# Altium project pay-ssm.PrjPCB (part 1 of 2)
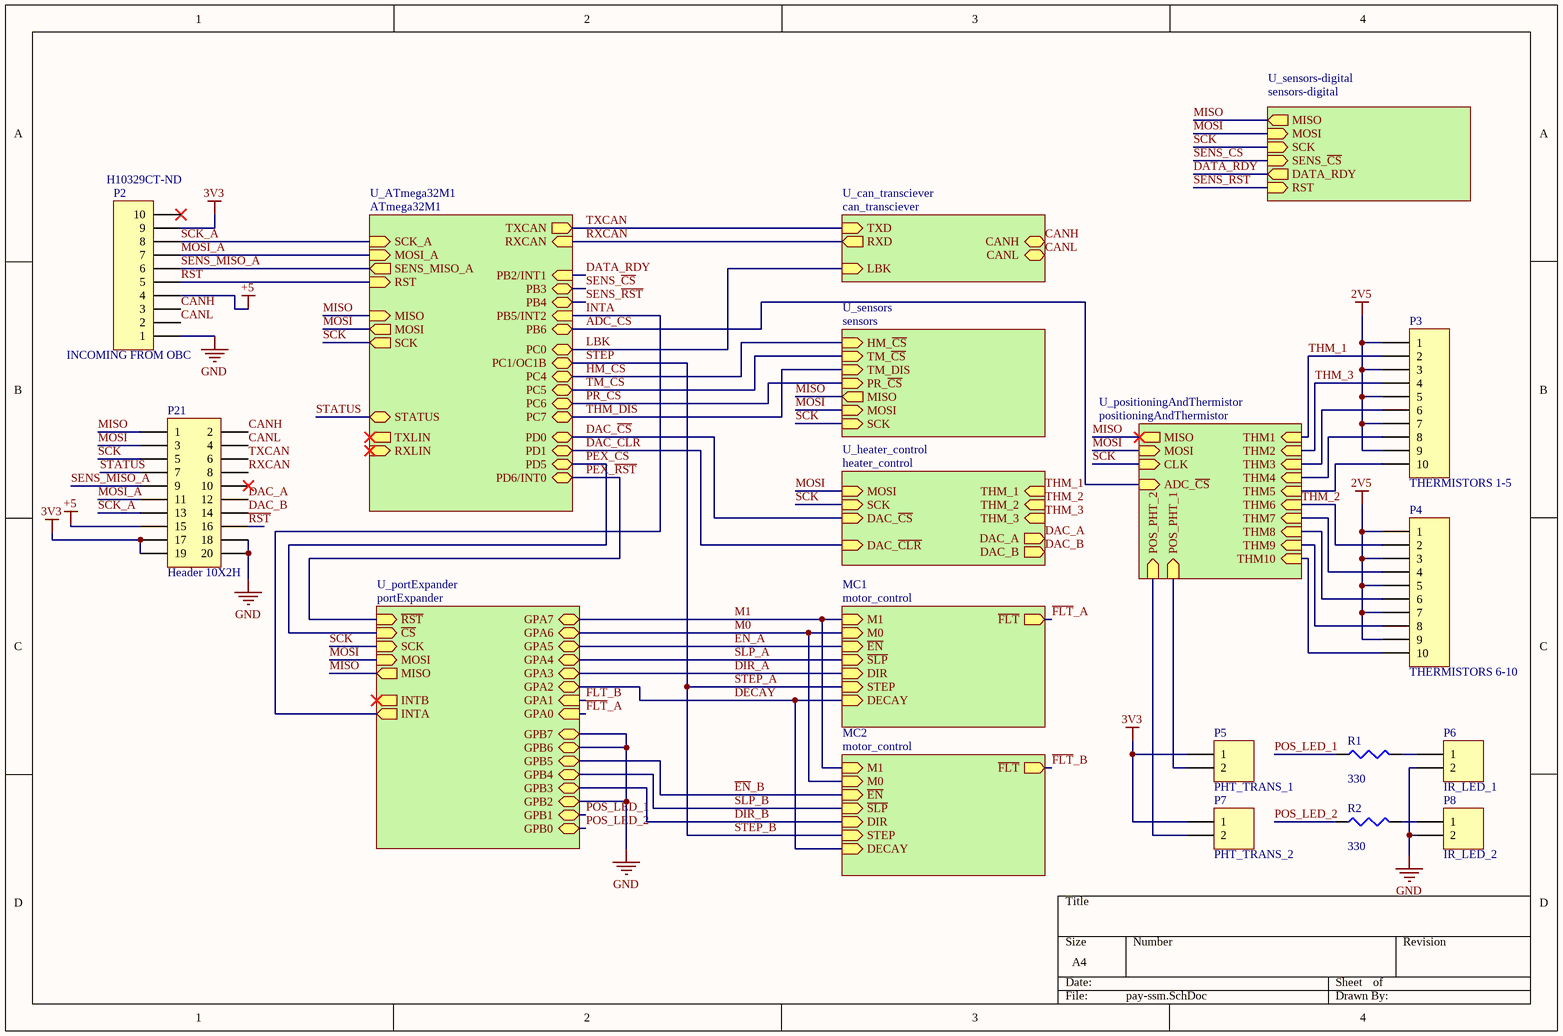
[diagram p0: pay-ssm.SchDoc]
13 sheets, 199 parts. Net scope: hierarchical (ports join the sheet entries above them; power ports are global).
Board files: pay-ssm.PcbDoc, pay-panel.PcbDoc
Sheets:
  pay-ssm.SchDoc
    U_ATmega32M1 = ATmega32M1.SchDoc
    U_can_transciever = can_transciever.SchDoc
    U_sensors = sensors.SchDoc
    U_heater_control = heater_control.SchDoc
      U_dac-layout = dac-layout.SchDoc
    MC2 = motor_control.SchDoc
    U_portExpander = portExpander.SchDoc
    MC1 = motor_control.SchDoc
    U_positioningAndThermistor = positioningAndThermistor.SchDoc
      U_thermistorADC = thermistorADC.SchDoc
    U_sensors-digital = sensors-digital.SchDoc
      optical_micro = microcontrollerOptical.SchDoc
  power2V5.SchDoc

## Sheet pay-ssm.SchDoc
size A4; DocumentNumber: 1; SheetNumber: 1; SheetTotal: 11

### Parts
P2  INCOMING FROM OBC  Supplier Part Number: H10329CT-ND  [DF14-10P-1.25H(55)]
P3  THERMISTORS 1-5  [DF14-10P-1.25H(55)]
P4  THERMISTORS 6-10  [DF14-10P-1.25H(55)]
P5  PHT_TRANS_1  [DF14-2P-1.25H(55)]
P6  IR_LED_1  [DF14-2P-1.25H(55)]
P7  PHT_TRANS_2  [DF14-2P-1.25H(55)]
P8  IR_LED_2  [DF14-2P-1.25H(55)]
P21  Header 10X2H  [HDR2X10]
R1  330  [J1-0603]
R2  330  [J1-0603]

### Sub-sheets
MC1 = motor_control: M1 (in), M0 (in), ~{EN} (in), ~{SLP} (in), DIR (in), STEP (in), DECAY (in), ~{FLT} (out)
MC2 = motor_control: M1 (in), M0 (in), ~{EN} (in), ~{SLP} (in), DIR (in), STEP (in), DECAY (in), ~{FLT} (out)
U_ATmega32M1 = ATmega32M1: MISO (in), MOSI (out), SCK (out), TXCAN (out), RXCAN (in), PB3 (bidir), PB4 (bidir), PB5/INT2 (in), PB6 (bidir), PC0 (bidir), PC4 (bidir), PC5 (bidir), PC6 (bidir), PC7 (bidir), PD0 (bidir), PD1 (bidir), PD5 (bidir), RXLIN (in), TXLIN (out), RST (in), MOSI_A (in), SCK_A (in), SENS_MISO_A (out), PC1/OC1B (bidir), PD6/INT0 (bidir), PB2/INT1 (in), STATUS (bidir)
U_can_transciever = can_transciever: RXD (out), TXD (in), LBK (in), CANL (bidir), CANH (bidir)
U_heater_control = heater_control: SCK (in), DAC_~{CLR} (in), MOSI (in), THM_2 (in), DAC_~{CS} (in), THM_1 (in), THM_3 (in), DAC_A (out), DAC_B (out)
U_portExpander = portExpander: ~{RST} (in), ~{CS} (in), SCK (in), MOSI (in), MISO (out), GPA7 (bidir), GPA6 (bidir), GPA5 (bidir), GPA4 (bidir), GPA3 (bidir), GPA2 (bidir), GPA1 (in), GPA0 (in), GPB7 (bidir), GPB6 (bidir), GPB5 (bidir), GPB4 (bidir), GPB3 (bidir), GPB2 (bidir), GPB1 (bidir), GPB0 (bidir), INTB (out), INTA (out)
U_positioningAndThermistor = positioningAndThermistor: THM1 (in), THM2 (in), THM3 (in), THM4 (in), THM5 (in), THM6 (in), THM7 (in), THM8 (in), THM9 (in), THM10 (in), MISO (out), MOSI (in), CLK (in), POS_PHT_2 (in), POS_PHT_1 (in), ADC_~{CS} (in)
U_sensors = sensors: HM_~{CS} (in), TM_~{CS} (in), TM_DIS (in), PR_~{CS} (in), SCK (in), MOSI (in), MISO (out)
U_sensors-digital = sensors-digital: MISO (out), MOSI (in), SCK (in), SENS_~{CS} (in), DATA_RDY (out), RST (in)

### Nets
2V5: P3.1 P3.3 P3.5 P3.7 P3.9 P4.1 P4.3 P4.5 P4.7 P4.9
3V3: P2.9 P5.1 P7.1 P21.17 P21.19
+5: P2.4 P21.15
GND: P2.1 P6.2 P8.2 P21.18 P21.20 ; sheet U_portExpander/GPB7, sheet U_portExpander/GPB6, sheet U_portExpander/GPB2
ADC_~{CS}: sheet U_ATmega32M1/PB6, sheet U_positioningAndThermistor/ADC_~{CS}
CANH: P2.3 P21.2 ; sheet U_can_transciever/CANH
CANL: P2.2 P21.4 ; sheet U_can_transciever/CANL
CH2: P3.6 ; sheet U_positioningAndThermistor/THM3
CH3: P3.8 ; sheet U_positioningAndThermistor/THM4
CH4: P3.10 ; sheet U_positioningAndThermistor/THM5
CH6: P4.6 ; sheet U_positioningAndThermistor/THM8
CH7: P4.4 ; sheet U_positioningAndThermistor/THM7
CH8: P4.8 ; sheet U_positioningAndThermistor/THM9
CH9: P4.10 ; sheet U_positioningAndThermistor/THM10
DAC_A: P21.12 ; sheet U_heater_control/DAC_A
DAC_B: P21.14 ; sheet U_heater_control/DAC_B
DAC_~{CLR}: sheet U_ATmega32M1/PD1, sheet U_heater_control/DAC_~{CLR}
DAC_~{CS}: sheet U_ATmega32M1/PD0, sheet U_heater_control/DAC_~{CS}
DATA_RDY: sheet U_ATmega32M1/PB2/INT1, sheet U_sensors-digital/DATA_RDY
DECAY: sheet MC2/DECAY, sheet U_portExpander/GPA2, sheet MC1/DECAY
DIR_A: sheet U_portExpander/GPA3, sheet MC1/DIR
DIR_B: sheet MC2/DIR, sheet U_portExpander/GPB3
~{EN}_A: sheet U_portExpander/GPA5, sheet MC1/~{EN}
~{EN}_B: sheet MC2/~{EN}, sheet U_portExpander/GPB5
~{FLT}_A: sheet U_portExpander/GPA0, sheet MC1/~{FLT}
~{FLT}_B: sheet MC2/~{FLT}, sheet U_portExpander/GPA1
HM_~{CS}: sheet U_ATmega32M1/PC4, sheet U_sensors/HM_~{CS}
INTA: sheet U_ATmega32M1/PB5/INT2, sheet U_portExpander/INTA
LBK: sheet U_ATmega32M1/PC0, sheet U_can_transciever/LBK
M0: sheet MC2/M0, sheet U_portExpander/GPA6, sheet MC1/M0
M1: sheet MC2/M1, sheet U_portExpander/GPA7, sheet MC1/M1
MISO: P21.1 ; sheet U_ATmega32M1/MISO, sheet U_sensors/MISO, sheet U_portExpander/MISO, sheet U_positioningAndThermistor/MISO, sheet U_sensors-digital/MISO
MOSI: P21.3 ; sheet U_ATmega32M1/MOSI, sheet U_sensors/MOSI, sheet U_heater_control/MOSI, sheet U_portExpander/MOSI, sheet U_positioningAndThermistor/MOSI, sheet U_sensors-digital/MOSI
MOSI_A: P2.7 P21.11 ; sheet U_ATmega32M1/TXLIN, sheet U_ATmega32M1/MOSI_A
PEX_~{CS}: sheet U_ATmega32M1/PD5, sheet U_portExpander/~{CS}
PEX_~{RST}: sheet U_ATmega32M1/PD6/INT0, sheet U_portExpander/~{RST}
POS_LED_1: R1.1 ; sheet U_portExpander/GPB1
POS_LED_2: R2.1 ; sheet U_portExpander/GPB0
POS_PHT_1: P5.2 ; sheet U_positioningAndThermistor/POS_PHT_1
POS_PHT_2: P7.2 ; sheet U_positioningAndThermistor/POS_PHT_2
PR_~{CS}: sheet U_ATmega32M1/PC6, sheet U_sensors/PR_~{CS}
~{RST}: P2.5 P21.16 ; sheet U_ATmega32M1/RST
RXCAN: P21.8 ; sheet U_ATmega32M1/RXCAN, sheet U_can_transciever/RXD
~{SLP}_A: sheet U_portExpander/GPA4, sheet MC1/~{SLP}
~{SLP}_B: sheet MC2/~{SLP}, sheet U_portExpander/GPB4
SCK: P21.5 ; sheet U_ATmega32M1/SCK, sheet U_sensors/SCK, sheet U_heater_control/SCK, sheet U_portExpander/SCK, sheet U_positioningAndThermistor/CLK, sheet U_sensors-digital/SCK
SCK_A: P2.8 P21.13 ; sheet U_ATmega32M1/SCK_A
SENS_~{CS}: sheet U_ATmega32M1/PB3, sheet U_sensors-digital/SENS_~{CS}
SENS_MISO_A: P2.6 P21.9 ; sheet U_ATmega32M1/SENS_MISO_A
SENS_~{RST}: sheet U_ATmega32M1/PB4, sheet U_sensors-digital/RST  [project net ~{RST}_OPTICAL]
STATUS: P21.7 ; sheet U_ATmega32M1/STATUS
STEP: sheet U_ATmega32M1/PC1/OC1B, sheet MC2/STEP, sheet MC1/STEP  [also labelled STEP_A, STEP_B]
THM_1: P3.2 ; sheet U_heater_control/THM_1, sheet U_positioningAndThermistor/THM1
THM_2: P4.2 ; sheet U_heater_control/THM_2, sheet U_positioningAndThermistor/THM6
THM_3: P3.4 ; sheet U_heater_control/THM_3, sheet U_positioningAndThermistor/THM2
THM_DIS: sheet U_ATmega32M1/PC7, sheet U_sensors/TM_DIS
TM_~{CS}: sheet U_ATmega32M1/PC5, sheet U_sensors/TM_~{CS}
TXCAN: P21.6 ; sheet U_ATmega32M1/TXCAN, sheet U_can_transciever/TXD
NetP6_1: P6.1 R1.2
NetP8_1: P8.1 R2.2

Not connected (* = marked no-connect by the designer): P2 10*; P21 10*

### Library data of the parts
P2-P4 = Header 10: Header, 10-Pin; LatestRevisionDate: 17-Jul-2002; LatestRevisionNote: Re-released for DXP Platform.; Publisher: Altium Limited; Supplier: Digi-Key
P5-P8 = Header 2: Header, 2-Pin; LatestRevisionDate: 17-Jul-2002; LatestRevisionNote: Re-released for DXP Platform.; Publisher: Altium Limited; Supplier: Digi-Key
P21 = Header 10X2H: Header, 10-Pin, Dual row, Right Angle; LatestRevisionDate: 17-Jul-2002; LatestRevisionNote: Re-released for DXP Platform.; Publisher: Altium Limited
R1 R2 = Res3: Resistor; Published: 8-Jun-2000; LatestRevisionDate: 29-May-2009; LatestRevisionNote: IPC-7351 Footprint Added.; PackageReference: J1-0603; Publisher: Altium Limited; PackageDescription: Chip Resistor; Value: 330; Supplier: Digi-Key

## Sheet ATmega32M1.SchDoc
size A4; DocumentNumber: 2; SheetNumber: 2; SheetTotal: 11
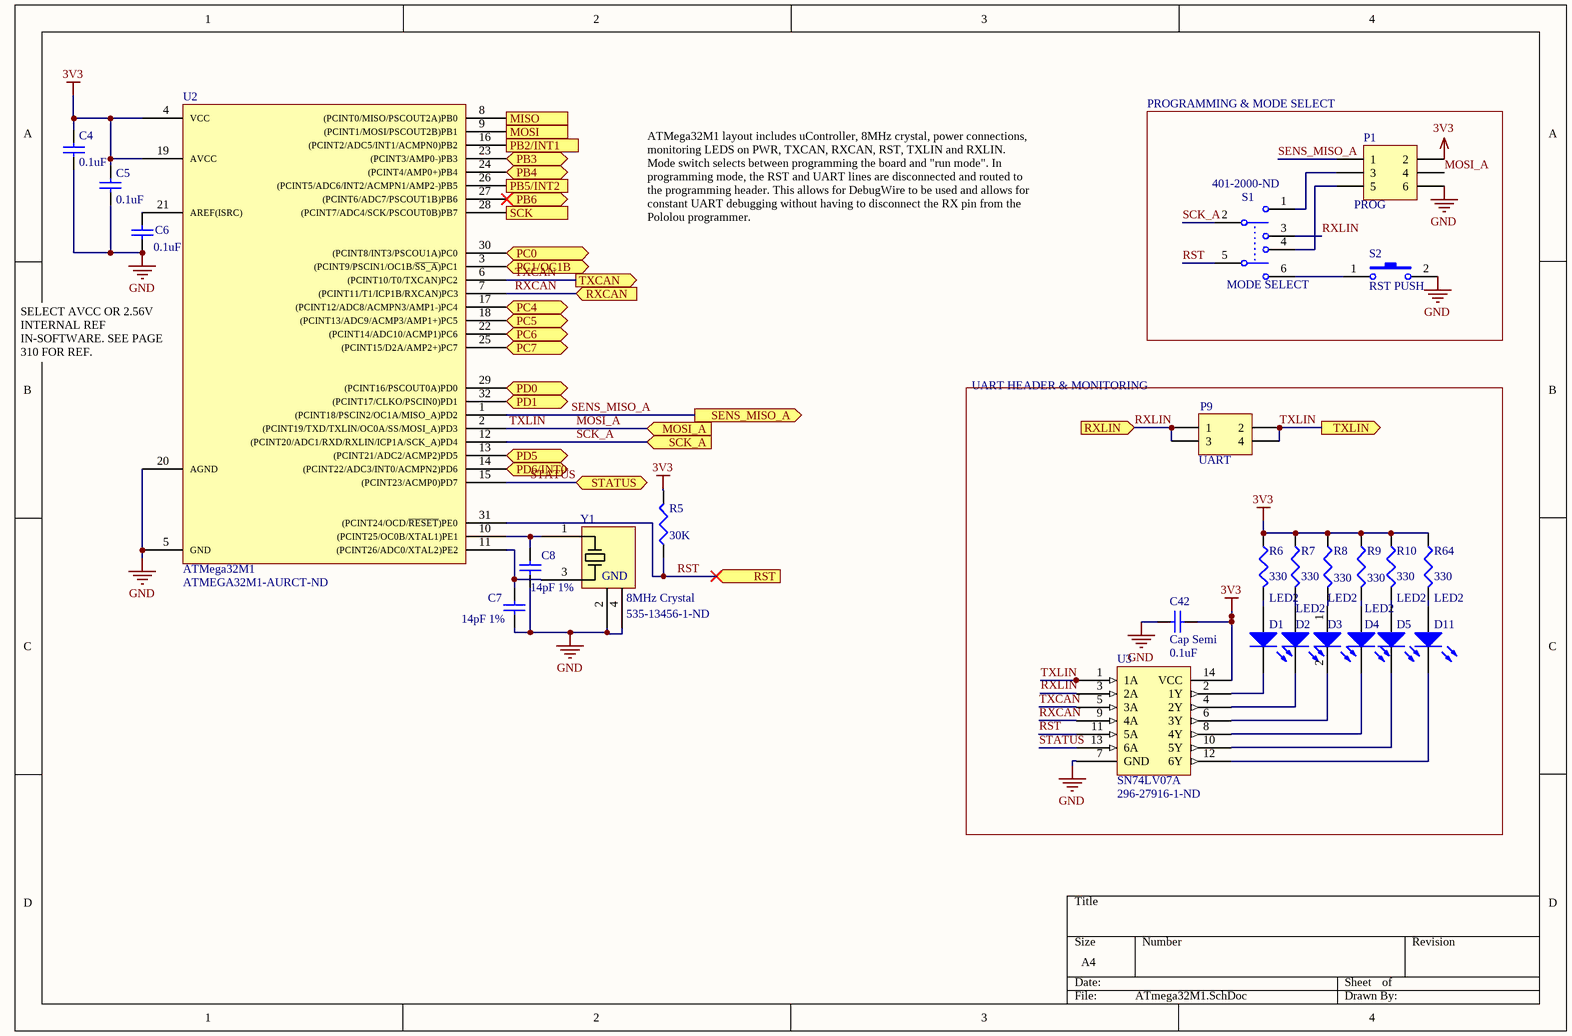
[diagram p1: ATmega32M1.SchDoc]

### Parts
C4  0.1uF  [1608[0603]]
C5  0.1uF  [1608[0603]]
C6  0.1uF  [1608[0603]]
C7  value 14pF 1%  [1608[0603]]  (hidden comment: 15pF 1%)
C8  value 14pF 1%  [1608[0603]]  (hidden comment: 15pF 1%)
C42  Cap Semi  value 0.1uF  [1608[0603]]
D1  LED2  [0603-LED]
D2  LED2  [0603-LED]
D3  LED2  [0603-LED]
D4  LED2  [0603-LED]
D5  LED2  [0603-LED]
D11  LED2  [0603-LED]
P1  PROG  [HDR2X3]
P9  UART  [HDR2X2]
R5  30K  [J1-0603]
R6  330  [J1-0603]
R7  330  [J1-0603]
R8  330  [J1-0603]
R9  330  [J1-0603]
R10  330  [J1-0603]
R64  330  [J1-0603]
S1  MODE SELECT  Supplier Part Number: 401-2000-ND  [DPST_32m1_switch]
S2  RST PUSH  [Pushbutton]
U2  ATMega32M1  Supplier Part Number 1: ATMEGA32M1-AURCT-ND  [QFP80P900X900X120-32N]
U3  SN74LV07A  Supplier Part Number: 296-27916-1-ND  [SOP65P640X120-14N]
Y1  8MHz Crystal  Supplier Part Number 1: 535-13456-1-ND  [OSCSC500X320X110-4N]

### Blocks framed on the sheet
PROGRAMMING & MODE SELECT: P1 S1 S2
UART HEADER & MONITORING: C42 D1-D5 D11 P9 R6-R10 R64 U3

### Ports
MISO (in), MOSI (out), MOSI_A (in), PB2/INT1 (in), PB3 (bidir), PB4 (bidir), PB5/INT2 (in), PB6 (bidir), PC0 (bidir), PC1/OC1B (bidir), PC4 (bidir), PC5 (bidir), PC6 (bidir), PC7 (bidir), PD0 (bidir), PD1 (bidir), PD5 (bidir), PD6/INT0 (bidir), RST (in), RXCAN (in), RXLIN (in), SCK (out), SCK_A (in), SENS_MISO_A (out), STATUS (bidir), TXCAN (out), TXLIN (out)

### Nets
3V3: C4.2 C5.2 C42.2 P1.2 R5.2 R6.1 R7.1 R8.1 R9.1 R10.1 R64.1 U2.4(VCC) U2.19(AVCC) U3.14(VCC)
GND: C4.1 C5.1 C6.2 C7.1 C8.1 C42.1 P1.6 S2.2 U2.5(GND) U2.20(AGND) U3.7(GND) Y1.2 Y1.4
ADC_~{CS}: U2.27((PCINT6/ADC7/PSCOUT1B)PB6) ; port PB6
DAC_~{CLR}: U2.32((PCINT17/CLKO/PSCIN0)PD1) ; port PD1
DAC_~{CS}: U2.29((PCINT16/PSCOUT0A)PD0) ; port PD0
DATA_RDY: U2.16((PCINT2/ADC5/INT1/ACMPN0)PB2) ; port PB2/INT1
HM_~{CS}: U2.17((PCINT12/ADC8/ACMPN3/AMP1-)PC4) ; port PC4
INTA: U2.26((PCINT5/ADC6/INT2/ACMPN1/AMP2-)PB5) ; port PB5/INT2
LBK: U2.30((PCINT8/INT3/PSCOU1A)PC0) ; port PC0
MISO: U2.8((PCINT0/MISO/PSCOUT2A)PB0) ; port MISO
MOSI: U2.9((PCINT1/MOSI/PSCOUT2B)PB1) ; port MOSI
MOSI_A: P1.4 P9.2 P9.4 U2.2((PCINT19/TXD/TXLIN/OC0A/SS/MOSI_A)PD3) U3.1(1A) ; port TXLIN, port MOSI_A  [also labelled TXLIN]
PEX_~{CS}: U2.13((PCINT21/ADC2/ACMP2)PD5) ; port PD5
PEX_~{RST}: U2.14((PCINT22/ADC3/INT0/ACMPN2)PD6) ; port PD6/INT0
PR_~{CS}: U2.22((PCINT14/ADC10/ACMP1)PC6) ; port PC6
~{RST}_OPTICAL: U2.24((PCINT4/AMP0+)PB4) ; port PB4
RST: R5.1 S1.5 U2.31((PCINT24/OCD/~{RESET})PE0) U3.11(5A) ; port RST  [project net ~{RST}]
RXCAN: U2.7((PCINT11/T1/ICP1B/RXCAN)PC3) U3.9(4A) ; port RXCAN
RXLIN: P9.1 P9.3 S1.3 U3.3(2A) ; port RXLIN
SCK: U2.28((PCINT7/ADC4/SCK/PSCOUT0B)PB7) ; port SCK
SCK_A: S1.2 U2.12((PCINT20/ADC1/RXD/RXLIN/ICP1A/SCK_A)PD4) ; port SCK_A
SENS_~{CS}: U2.23((PCINT3/AMP0-)PB3) ; port PB3
SENS_MISO_A: P1.1 U2.1((PCINT18/PSCIN2/OC1A/MISO_A)PD2) ; port SENS_MISO_A
STATUS: U2.15((PCINT23/ACMP0)PD7) U3.13(6A) ; port STATUS
STEP: U2.3((PCINT9/PSCIN1/OC1B/~{SS_A})PC1) ; port PC1/OC1B
THM_DIS: U2.25((PCINT15/D2A/AMP2+)PC7) ; port PC7
TM_~{CS}: U2.18((PCINT13/ADC9/ACMP3/AMP1+)PC5) ; port PC5
TXCAN: U2.6((PCINT10/T0/TXCAN)PC2) U3.5(3A) ; port TXCAN
NetC6_1: C6.1 U2.21(AREF(ISRC))
NetC7_2: C7.2 U2.11((PCINT26/ADC0/XTAL2)PE2) Y1.3(IN)
NetC8_2: C8.2 U2.10((PCINT25/OC0B/XTAL1)PE1) Y1.1(IN)
NetD1_1: D1.1(A) R6.2
NetD1_2: D1.2(K) U3.2(1Y)
NetD2_1: D2.1(A) R7.2
NetD2_2: D2.2(K) U3.4(2Y)
NetD3_1: D3.1(A) R8.2
NetD3_2: D3.2(K) U3.6(3Y)
NetD4_1: D4.1(A) R9.2
NetD4_2: D4.2(K) U3.8(4Y)
NetD5_1: D5.1(A) R10.2
NetD5_2: D5.2(K) U3.10(5Y)
NetD11_1: D11.1(A) R64.2
NetD11_2: D11.2(K) U3.12(6Y)
NetP1_3: P1.3 S1.1
NetP1_5: P1.5 S1.4
NetS1_6: S1.6 S2.1

### Notes on the sheet
- ATMega32M1 layout includes uController, 8MHz crystal, power connections, monitoring LEDS on PWR, TXCAN, RXCAN, RST, TXLIN and RXLIN. Mode switch selects between programming the board and "run mode". In programming mode, the RST and UART lines are disconnected and routed to the programming header. This allows for DebugWire to be used and allows for constant UART debugging without having to disconnect the RX pin from the Pololou programmer.
- (near U2) SELECT AVCC OR 2.56V INTERNAL REF IN-SOFTWARE. SEE PAGE 310 FOR REF.
- (in symbol 8MHz Abracom 4-Pin Crystal) GND

### Library data of the parts
C4-C8 C42 = Cap Semi: Capacitor (Semiconductor SIM Model); Published: 8-Jun-2000; LatestRevisionDate: 29-May-2009; LatestRevisionNote: IPC-7351 Footprint Added.; PackageReference: C1206; Publisher: Altium Limited; PackageDescription: Chip Capacitor
  C4-C6: Value: 0.1uF; Supplier: Digi-Key; Supplier Part Number: 587-3807-1-ND
  C7 C8: Supplier: Digi-Key; Supplier Part Number: 490-16416-1-ND
D1-D5 D11 = LED2: Typical RED, GREEN, YELLOW, AMBER GaAs LED; Published: 8-Jun-2000; LatestRevisionDate: 17-Jul-2002; LatestRevisionNote: Re-released for DXP Platform.; PackageVersion: Feb-2002; PackageReference: 3.2X1.6X1.1; Publisher: Altium Limited; PackageDescription: SM LED; 2 Flat Leads; Supplier: Digi-Key
P1 = Header 3X2: Header, 3-Pin, Dual row; LatestRevisionDate: 17-Jul-2002; LatestRevisionNote: Re-released for DXP Platform.; Publisher: Altium Limited; Supplier: Digi-Key
P9 = Header 2X2: Header, 2-Pin, Dual row; LatestRevisionDate: 17-Jul-2002; LatestRevisionNote: Re-released for DXP Platform.; Publisher: Altium Limited; Supplier: Digi-Key
R5-R10 R64 = Res3: Resistor; Published: 8-Jun-2000; LatestRevisionDate: 29-May-2009; LatestRevisionNote: IPC-7351 Footprint Added.; PackageReference: J1-0603; Publisher: Altium Limited; PackageDescription: Chip Resistor; Supplier: Digi-Key
  R5: Value: 30K
  R6-R10 R64: Value: 330
S1 = SW-DPDT: Double-Pole, Double-Throw Switch; Published: 24-Mar-1999; LatestRevisionDate: 17-Jul-2002; LatestRevisionNote: Re-released for DXP Platform.; PackageReference: DPDT-6; Publisher: Altium Limited; PackageDescription: Switch; 6 Leads; Supplier: Digi-Key
S2 = SW-PB: Switch; Published: 24-Mar-1999; LatestRevisionDate: 17-Jul-2002; LatestRevisionNote: Re-released for DXP Platform.; PackageReference: SPST-2; Publisher: Altium Limited; PackageDescription: Switch; 2 Leads; Supplier: Digi-Key; Supplier Part Number: CKN10587CT-ND
U2 = ATMega32M1: Atmel 8-bit AVR microcontroller.; Supplier 1: Digi-Key; Supplier: Digi-Key
U3 = SN74LV07A: Six element 1-bit non-inverting open-drain buffer.; Supplier: Digi-Key
Y1 = 8MHz Abracom 4-Pin Crystal: 8MHz Abracom 4-pin crystal.; Supplier 1: Digi-Key

## Sheet can_transciever.SchDoc: SN65HVD233 Layout
size A4; DrawnBy: Dylan Vogel; DocumentNumber: 3; Revision: 1.0; SheetNumber: 3; SheetTotal: 11
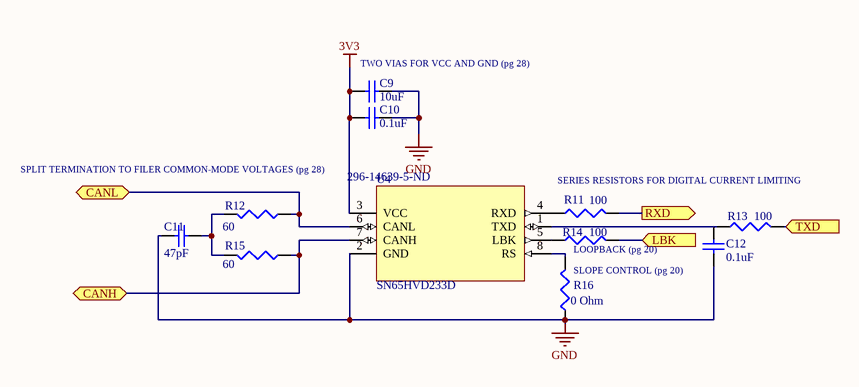
[diagram p2: can_transciever.SchDoc]

### Parts
C9  10uF  [1608[0603]]
C10  0.1uF  [1608[0603]]
C11  47pF  [1608[0603]]
C12  0.1uF  [1608[0603]]
R11  100  [J1-0603]
R12  60  [J1-0603]
R13  100  [J1-0603]
R14  100  [J1-0603]
R15  60  [J1-0603]
R16  0 Ohm  [J1-0603]
U4  SN65HVD233D  Supplier Part Number 1: 296-14639-5-ND  [SOIC127P500X600-8N]

### Ports
CANH (bidir), CANL (bidir), LBK (in), RXD (out), TXD (in)

### Nets
3V3: C9.2 C10.2 U4.3(VCC)
GND: C9.1 C10.1 C11.1 C12.1 R16.1 U4.2(GND)
CANH: R15.1 U4.7(CANH) ; port CANH
CANL: R12.1 U4.6(CANL) ; port CANL
LBK: R14.2 ; port LBK
RXCAN: R11.2 ; port RXD
TXCAN: R13.2 ; port TXD
NetC11_2: C11.2 R12.2 R15.2
NetC12_2: C12.2 R13.1 U4.1(TXD)
NetR11_1: R11.1 U4.4(RXD)
NetR14_1: R14.1 U4.5(LBK)
NetR16_2: R16.2 U4.8(RS)

### Notes on the sheet
- (near C9) TWO VIAS FOR VCC AND GND (pg 28)
- SPLIT TERMINATION TO FILER COMMON-MODE VOLTAGES (pg 28)
- SERIES RESISTORS FOR DIGITAL CURRENT LIMITING
- (near R14) LOOPBACK (pg 20)
- (near R16) SLOPE CONTROL (pg 20)

### Library data of the parts
C9-C12 = Cap Semi: Capacitor (Semiconductor SIM Model); Published: 8-Jun-2000; LatestRevisionDate: 29-May-2009; LatestRevisionNote: IPC-7351 Footprint Added.; PackageReference: C1206; Publisher: Altium Limited; PackageDescription: Chip Capacitor; Supplier: Digi-Key
  C9: Value: 10uF; Supplier Part Number: 587-3258-1-ND
  C10 C12: Value: 0.1uF; Supplier Part Number: 587-3807-1-ND
  C11: Value: 47pF; Supplier Part Number: 587-5087-1-ND
R11-R16 = Res3: Resistor; Published: 8-Jun-2000; LatestRevisionDate: 29-May-2009; LatestRevisionNote: IPC-7351 Footprint Added.; PackageReference: J1-0603; Publisher: Altium Limited; PackageDescription: Chip Resistor; Supplier: Digi-Key
  R11 R13 R14: Value: 100
  R12 R15: Value: 60
  R16: Value: 0 Ohm
U4 = SN65HVD233D: 3.3V CAN Transceiver with Standby Mode, Loop-back 8-SOIC -40 to 125; MF: Texas Instruments; MP: SN65HVD233D; Package: SOIC-8 Texas Instruments; Availability: Good; SnapEDA_Link: https://www.snapeda.com/parts/SN65HVD233D/Texas%20Instruments/view-part/?ref=snap; Price: 2.39 USD; Value: *; Supplier 1: Digi-Key; Supplier: Digi-Key

## Sheet sensors.SchDoc
size A4; DocumentNumber: 9; SheetNumber: 9; SheetTotal: 11
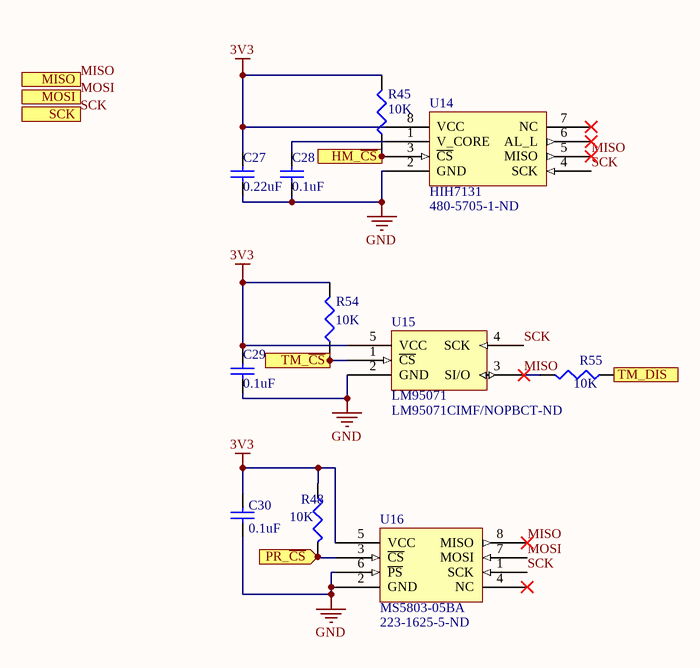
[diagram p3: sensors.SchDoc]

### Parts
(Parts that share a designator on the sheet are numbered #1, #2 ... from top to bottom, then left to right.)
C27  0.22uF  [1608[0603]]
C28  0.1uF  [1608[0603]]
C29  0.1uF  [1608[0603]]
C30  0.1uF  [1608[0603]]
R45  10K  [J1-0603]
R48  10K  [J1-0603]
R54#1  10K  [J1-0603]
R55#1  10K  [J1-0603]
U14  HIH7131  Supplier Part Number 1: 480-5705-1-ND  [SOIC127P500X600-8N]
U15  LM95071  Supplier Part Number 1: LM95071CIMF/NOPBCT-ND  [SOT-23-5_95P290X160-5N]
U16  MS5803-05BA  Supplier Part Number 1: 223-1625-5-ND  [MS5803-05BA_125P640x620-8N]

### Ports
HM_~{CS} (in), MISO (out), MOSI (in), PR_~{CS} (in), SCK (in), TM_DIS (in), TM_~{CS} (in)

### Nets
3V3: C27.2 C29.2 C30.2 R45.2 R48.1 R54#1.2 U14.8(VCC) U15.5(VCC) U16.5(VCC)
GND: C27.1 C28.1 C29.1 C30.1 U14.2(GND) U15.2(GND) U16.2(GND) U16.6(~{PS})
HM_~{CS}: R45.1 U14.3(~{CS}) ; port HM_~{CS}
MISO: R55#1.2 U14.5(MISO) U15.3(SI/O) U16.8(MISO) ; port MISO
MOSI: U16.7(MOSI) ; port MOSI
PR_~{CS}: R48.2 U16.3(~{CS}) ; port PR_~{CS}
SCK: U14.4(SCK) U15.4(SCK) U16.1(SCK) ; port SCK
THM_DIS: R55#1.1 ; port TM_DIS
TM_~{CS}: R54#1.1 U15.1(~{CS}) ; port TM_~{CS}
NetC28_2: C28.2 U14.1(V_CORE)

Not connected (* = marked no-connect by the designer): U14 6(AL_L)* 7(NC)*; U16 4(NC)*

### Library data of the parts
C27-C30 = Cap Semi: Capacitor (Semiconductor SIM Model); Published: 8-Jun-2000; LatestRevisionDate: 29-May-2009; LatestRevisionNote: IPC-7351 Footprint Added.; PackageReference: C1206; Publisher: Altium Limited; PackageDescription: Chip Capacitor; Supplier: Digi-Key
  C27: Value: 0.22uF; Supplier Part Number: 1276-1112-1-ND
  C28-C30: Value: 0.1uF; Supplier Part Number: 587-3807-1-ND
R45 R48 R54#1 R55#1 = Res3: Resistor; Published: 8-Jun-2000; LatestRevisionDate: 29-May-2009; LatestRevisionNote: IPC-7351 Footprint Added.; PackageReference: J1-0603; Publisher: Altium Limited; PackageDescription: Chip Resistor; Value: 10K; Supplier: Digi-Key
U14 = HIH7131: Digital humidity/temperature sensors. +/- 3% RH, 0-100%, SPI output. Model version with filter and condensation resistant.; Supplier 1: Digi-Key; Supplier: Digi-Key
U15 = LM95071: 13 bit plus sign digital temperature sensor. Nominal +/- 1 C accuracy from 0-70 C.; Supplier 1: Digi-Key; Supplier: Digi-Key
U16 = MS5803-05BA: Digital 24-bit pressure sensor with SPI output. Operating range from 0-5bar, includes onboard temperature sensor and hermetic seal.; Supplier 1: Digi-Key; Supplier: Digi-Key

## Sheet heater_control.SchDoc
size A4; DocumentNumber: 4; SheetNumber: 4; SheetTotal: 11
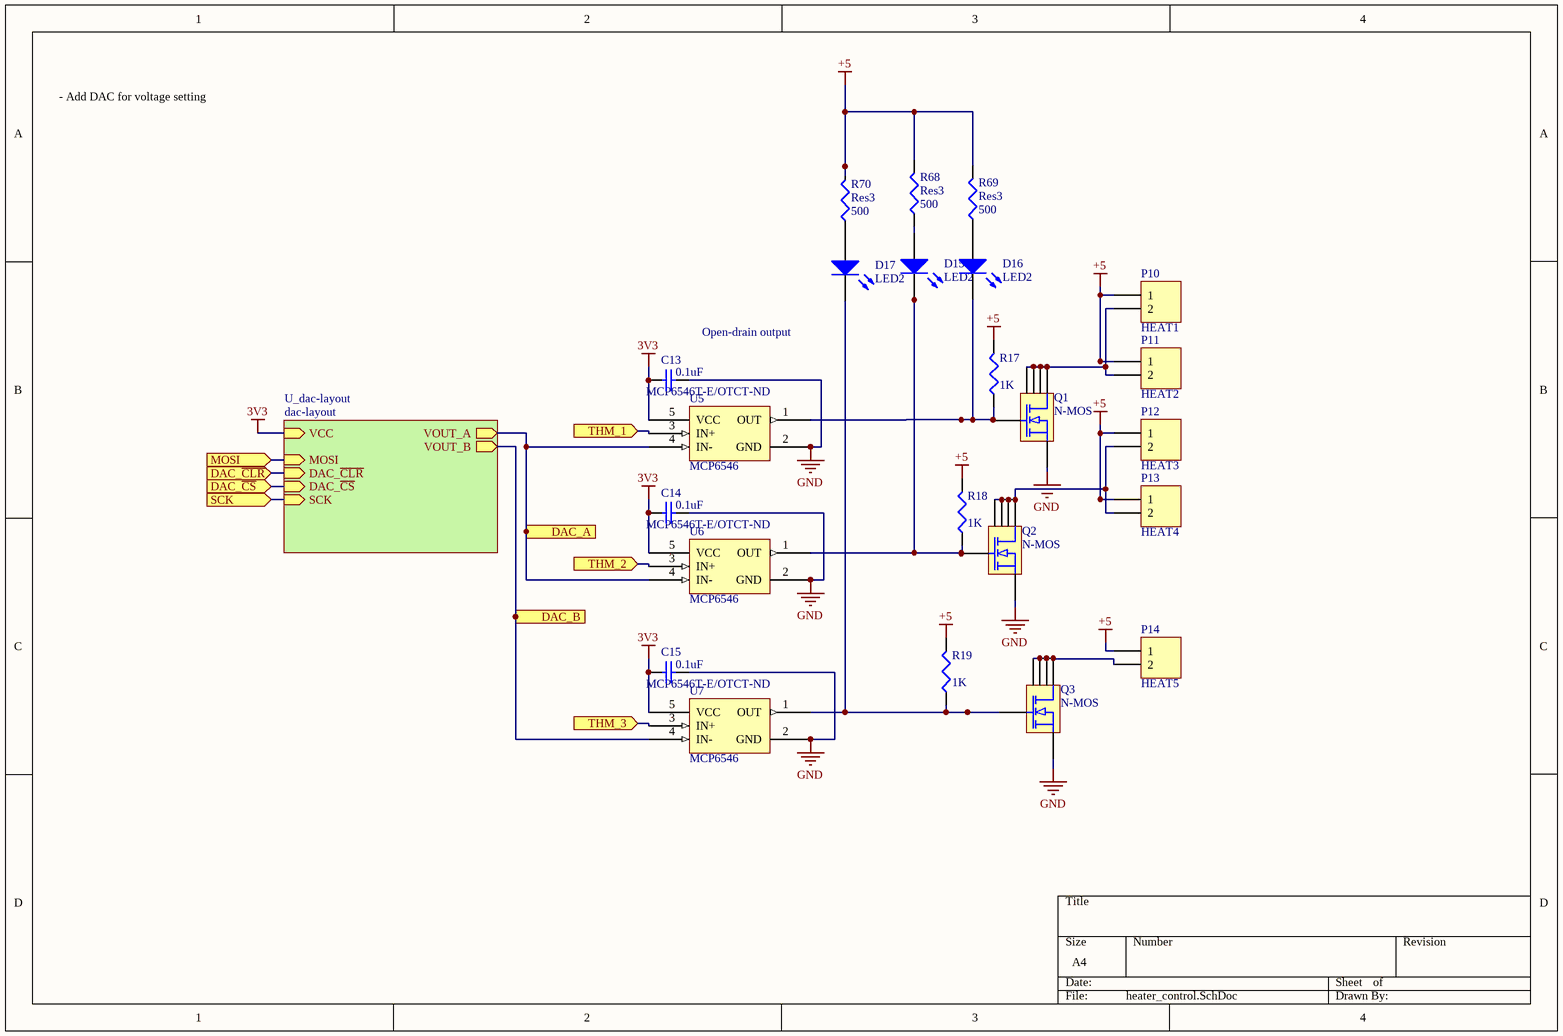
[diagram p4: heater_control.SchDoc]

### Parts
C13  0.1uF  [1608[0603]]
C14  0.1uF  [1608[0603]]
C15  value 0.1uF  [1608[0603]]  (hidden comment: 100pF)
D15  LED2  [0603-LED]
D16  LED2  [0603-LED]
D17  LED2  [0603-LED]
P10  HEAT1  [DF14-2P-1.25H(55)]
P11  HEAT2  [DF14-2P-1.25H(55)]
P12  HEAT3  [DF14-2P-1.25H(55)]
P13  HEAT4  [DF14-2P-1.25H(55)]
P14  HEAT5  [DF14-2P-1.25H(55)]
Q1  N-MOS  [SOT23-6_N]
Q2  N-MOS  [SOT23-6_N]
Q3  N-MOS  [SOT23-6_N]
R17  1K  [J1-0603]
R18  1K  [J1-0603]
R19  1K  [J1-0603]
R68  Res3  value 500  [J1-0603]
R69  Res3  value 500  [J1-0603]
R70  Res3  value 500  [J1-0603]
U5  MCP6546  Supplier Part Number 1: MCP6546T-E/OTCT-ND  [SOT-23-5_95P290X160-5N]
U6  MCP6546  Supplier Part Number 1: MCP6546T-E/OTCT-ND  [SOT-23-5_95P290X160-5N]
U7  MCP6546  Supplier Part Number 1: MCP6546T-E/OTCT-ND  [SOT-23-5_95P290X160-5N]

### Sub-sheets
U_dac-layout = dac-layout: VOUT_A (out), VOUT_B (out), DAC_~{CS} (in), SCK (in), MOSI (in), DAC_~{CLR} (in), VCC (in)

### Ports
DAC_A (out), DAC_B (out), DAC_~{CLR} (in), DAC_~{CS} (in), MOSI (in), SCK (in), THM_1 (in), THM_2 (in), THM_3 (in)

### Nets
3V3: C13.1 C14.1 C15.1 U5.5(VCC) U6.5(VCC) U7.5(VCC) ; sheet U_dac-layout/VCC
+5: P10.1 P11.1 P12.1 P13.1 P14.1 R17.2 R18.2 R19.2 R68.2 R69.2 R70.2
GND: C13.2 C14.2 C15.2 Q1.4(S) Q2.4(S) Q3.4(S) U5.2(GND) U6.2(GND) U7.2(GND)
DAC_A: U5.4(IN-) U6.4(IN-) ; port DAC_A, sheet U_dac-layout/VOUT_A
DAC_B: U7.4(IN-) ; port DAC_B, sheet U_dac-layout/VOUT_B
DAC_~{CLR}: port DAC_~{CLR}, sheet U_dac-layout/DAC_~{CLR}
DAC_~{CS}: port DAC_~{CS}, sheet U_dac-layout/DAC_~{CS}
MOSI: port MOSI, sheet U_dac-layout/MOSI
SCK: port SCK, sheet U_dac-layout/SCK
THM_1: U5.3(IN+) ; port THM_1
THM_2: U6.3(IN+) ; port THM_2
THM_3: U7.3(IN+) ; port THM_3
NetD15_1: D15.1(A) R68.1
NetD15_2: D15.2(K) Q2.3(G) R18.1 U6.1(OUT)
NetD16_1: D16.1(A) R69.1
NetD16_2: D16.2(K) Q1.3(G) R17.1 U5.1(OUT)
NetD17_1: D17.1(A) R70.1
NetD17_2: D17.2(K) Q3.3(G) R19.1 U7.1(OUT)
NetP10_2: P10.2 P11.2 Q1.1(D) Q1.2(D) Q1.5(D) Q1.6(D)
NetP12_2: P12.2 P13.2 Q2.1(D) Q2.2(D) Q2.5(D) Q2.6(D)
NetP14_2: P14.2 Q3.1(D) Q3.2(D) Q3.5(D) Q3.6(D)

### Notes on the sheet
- - Add DAC for voltage setting
- When THM below reference (cold), output is high impedance and MOSFET is ON
  When THM above reference (hot) output is connected to GND and MOSFET is OFF
- MOSFET ON connects the heaters to GND, which turns them ON
- Open-drain output

### Library data of the parts
C13-C15 = Cap Semi: Capacitor (Semiconductor SIM Model); Published: 8-Jun-2000; LatestRevisionDate: 29-May-2009; LatestRevisionNote: IPC-7351 Footprint Added.; PackageReference: C1206; Publisher: Altium Limited; PackageDescription: Chip Capacitor; Supplier: Digi-Key
  C13 C14: Value: 0.1uF; Supplier Part Number: 587-3807-1-ND
  C15: Supplier Part Number: 1276-1972-1-ND
D15-D17 = LED2: as D1 on sheet ATmega32M1; Published: 8-Jun-2000; LatestRevisionDate: 17-Jul-2002; LatestRevisionNote: Re-released for DXP Platform.; PackageVersion: Feb-2002; PackageReference: 3.2X1.6X1.1; Publisher: Altium Limited; PackageDescription: SM LED; 2 Flat Leads
P10-P14 = Header 2: Header, 2-Pin; LatestRevisionDate: 17-Jul-2002; LatestRevisionNote: Re-released for DXP Platform.; Publisher: Altium Limited; Supplier: Digi-Key
Q1-Q3 = FDC637BNZCT-ND: N-MOS, low gate ON voltage; Supplier: Digi-Key; Supplier Part Number: FDC637BNZCT-ND
R17-R19 R68-R70 = Res3: Resistor; Published: 8-Jun-2000; LatestRevisionDate: 29-May-2009; LatestRevisionNote: IPC-7351 Footprint Added.; PackageReference: J1-0603; Publisher: Altium Limited; PackageDescription: Chip Resistor
  R17-R19: Value: 1K; Supplier: Digi-Key
U5-U7 = MCP6546: Open-drain output sub-microamp comparator.; Supplier 1: Digi-Key

## Sheet dac-layout.SchDoc: DAC
size A4; DrawnBy: Dylan Vogel; Organization: UTAT SS; DocumentNumber: 10; Revision: 1; SheetNumber: 10; SheetTotal: 11
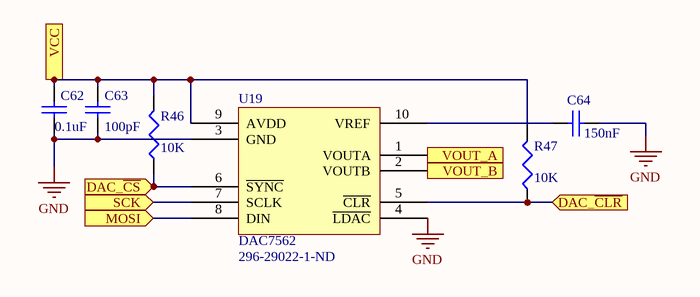
[diagram p5: dac-layout.SchDoc]

### Parts
(Parts that share a designator on the sheet are numbered #1, #2 ... from top to bottom, then left to right.)
C62  0.1uF  [0402]
C63  100pF  [0402]
C64  150nF  [0402]
R46  10K  [0402]
R47  10K  [0402]
U19#1  DAC7562  Supplier Part Number 1: 296-29022-1-ND  [SOP10-50P300X300-10N]

### Ports
DAC_~{CLR} (in), DAC_~{CS} (in), MOSI (in), SCK (in), VCC (in), VOUT_A (out), VOUT_B (out)

### Nets
3V3: C62.2 C63.2 R46.2 R47.2 U19#1.9(AVDD) ; port VCC
GND: C62.1 C63.1 C64.2 U19#1.3(GND) U19#1.4(~{LDAC})
DAC_A: U19#1.1(VOUTA) ; port VOUT_A
DAC_B: U19#1.2(VOUTB) ; port VOUT_B
DAC_~{CLR}: R47.1 U19#1.5(~{CLR}) ; port DAC_~{CLR}
DAC_~{CS}: R46.1 U19#1.6(~{SYNC}) ; port DAC_~{CS}
MOSI: U19#1.8(DIN) ; port MOSI
SCK: U19#1.7(SCLK) ; port SCK
NetC64_1: C64.1 U19#1.10(VREF)

### Library data of the parts
C62-C64 = Cap Semi: Capacitor (Semiconductor SIM Model); Published: 8-Jun-2000; LatestRevisionDate: 29-May-2009; LatestRevisionNote: IPC-7351 Footprint Added.; PackageReference: C1206; Publisher: Altium Limited; PackageDescription: Chip Capacitor; Supplier: Digi-Key
  C62: Value: 0.1uF; Supplier Part Number: 587-3807-1-ND
  C63: Value: 100pF; Supplier Part Number: 1276-1632-1-ND
  C64: Value: 150nF; Supplier Part Number: 1276-1972-1-ND
R46 R47 = Res3: Resistor; Published: 8-Jun-2000; LatestRevisionDate: 29-May-2009; LatestRevisionNote: IPC-7351 Footprint Added.; PackageReference: J1-0603; Publisher: Altium Limited; PackageDescription: Chip Resistor; Value: 10K; Supplier: Digi-Key
U19#1 = DAC7562: 12-bit, low-power, voltage-output DAC with internal reference.; Supplier 1: Digi-Key; Supplier: Digi-Key

## Sheet motor_control.SchDoc
size A4; DocumentNumber: 5; SheetNumber: 5; SheetTotal: 11
Used 2 times, as channels MC2, MC1. Parts and nets are listed once, with the designators drawn on the sheet.
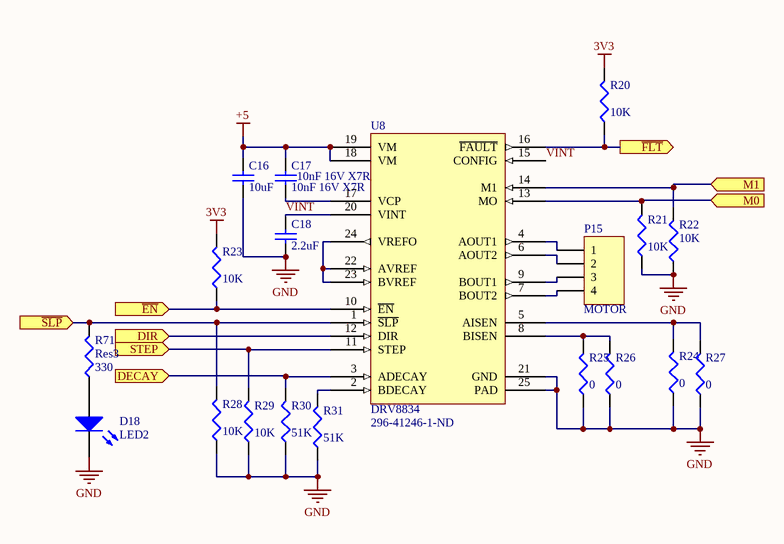
[diagram p6: motor_control.SchDoc]

### Parts
C16  10uF  [1608[0603]]
C17  10nF 16V X7R  [1608[0603]]
C18  2.2uF  [1608[0603]]
D18  LED2  [0603-LED]
P15  MOTOR  [DF14-4P-1.25H(55)]
R20  10K  [J1-0603]
R21  10K  [J1-0603]
R22  10K  [J1-0603]
R23  10K  [J1-0603]
R24  0  [J1-0603]
R25  0  [J1-0603]
R26  0  [J1-0603]
R27  0  [J1-0603]
R28  10K  [J1-0603]
R29  10K  [J1-0603]
R30  51K  [J1-0603]
R31  51K  [J1-0603]
R71  Res3  value 330  [J1-0603]
U8  DRV8834  Supplier Part Number 1: 296-41246-1-ND  [SOP65P640X120-25N]

### Ports
DECAY (in), DIR (in), M0 (in), M1 (in), STEP (in), ~{EN} (in), ~{FLT} (out), ~{SLP} (in)

### Nets
3V3: R20.2 R23.2
+5: C16.2 C17.2 U8.18(VM) U8.19(VM)
GND: C16.1 C18.1 D18.2(K) R21.1 R22.1 R24.1 R25.1 R26.1 R27.1 R28.1 R29.1 R30.1 R31.1 U8.21(GND) U8.25(PAD)
DECAY: R30.2 U8.3(ADECAY) ; port DECAY
DIR: U8.12(DIR) ; port DIR
~{EN}: R23.1 U8.10(~{EN}) ; port ~{EN}
~{FLT}: R20.1 U8.16(~{FAULT}) ; port ~{FLT}
M0: R21.2 U8.13(MO) ; port M0
M1: R22.2 U8.14(M1) ; port M1
~{SLP}: R28.2 R71.2 U8.1(~{SLP}) ; port ~{SLP}
STEP: R29.2 U8.11(STEP) ; port STEP
VINT: C18.2 U8.15(CONFIG) U8.20(VINT)
NetC17_1: C17.1 U8.17(VCP)
NetD18_1: D18.1(A) R71.1
NetP15_1: P15.1 U8.4(AOUT1)
NetP15_2: P15.2 U8.6(AOUT2)
NetP15_3: P15.3 U8.9(BOUT1)
NetP15_4: P15.4 U8.7(BOUT2)
NetR24_2: R24.2 R27.2 U8.5(AISEN)
NetR25_2: R25.2 R26.2 U8.8(BISEN)
NetR31_2: R31.2 U8.2(BDECAY)
NetU8_22: U8.22(AVREF) U8.23(BVREF) U8.24(VREFO)

### Channels
MC2: designators C16=C16_MC2 C17=C17_MC2 C18=C18_MC2 D18=D18_MC2 P15=P16_MC2 R20=R20_MC2 R21=R21_MC2 R22=R22_MC2 R23=R23_MC2 R24=R24_MC2 R25=R25_MC2 R26=R26_MC2 R27=R27_MC2 R28=R28_MC2 R29=R29_MC2 R30=R30_MC2 R31=R31_MC2 R71=R71_MC2 U8=U8_MC2; ports DECAY=DECAY DIR=DIR_B M0=M0 M1=M1 STEP=STEP ~{EN}=~{EN}_B ~{FLT}=~{FLT}_B ~{SLP}=~{SLP}_B
MC1: designators C16=C16_MC1 C17=C17_MC1 C18=C18_MC1 D18=D18_MC1 P15=P16_MC1 R20=R20_MC1 R21=R21_MC1 R22=R22_MC1 R23=R23_MC1 R24=R24_MC1 R25=R25_MC1 R26=R26_MC1 R27=R27_MC1 R28=R28_MC1 R29=R29_MC1 R30=R30_MC1 R31=R31_MC1 R71=R71_MC1 U8=U8_MC1; ports DECAY=DECAY DIR=DIR_A M0=M0 M1=M1 STEP=STEP ~{EN}=~{EN}_A ~{FLT}=~{FLT}_A ~{SLP}=~{SLP}_A

### Notes on the sheet
- (near U8) Logic high enables indexer mode
- When voltage on these pins is >0.5 V outputs are turned off
- Calculations in datasheet for placing small current sense resistors here for current limiting.
  Parallel to increase heat sinking capability. Should be properly rated.

### Library data of the parts
C16-C18 = Cap Semi: Capacitor (Semiconductor SIM Model); Published: 8-Jun-2000; LatestRevisionDate: 29-May-2009; LatestRevisionNote: IPC-7351 Footprint Added.; PackageReference: C1206; Publisher: Altium Limited; PackageDescription: Chip Capacitor; Supplier: Digi-Key
  C16: Value: 10uF; Supplier Part Number: 587-3258-1-ND
  C17: Value: 10nF 16V X7R; Supplier Part Number: 587-2708-1-ND
  C18: Value: 2.2uF; Supplier Part Number: 1276-1085-1-ND
D18 = LED2: as D1 on sheet ATmega32M1; Published: 8-Jun-2000; LatestRevisionDate: 17-Jul-2002; LatestRevisionNote: Re-released for DXP Platform.; PackageVersion: Feb-2002; PackageReference: 3.2X1.6X1.1; Publisher: Altium Limited; PackageDescription: SM LED; 2 Flat Leads
P15 = Header 4: Header, 4-Pin; LatestRevisionDate: 17-Jul-2002; LatestRevisionNote: Re-released for DXP Platform.; Publisher: Altium Limited; Supplier: Digi-Key
R20-R31 R71 = Res3: Resistor; Published: 8-Jun-2000; LatestRevisionDate: 29-May-2009; LatestRevisionNote: IPC-7351 Footprint Added.; PackageReference: J1-0603; Publisher: Altium Limited; PackageDescription: Chip Resistor
  R20-R23 R28 R29: Value: 10K; Supplier: Digi-Key
  R24-R27: Value: 0; Supplier: Digi-Key
  R30 R31: Value: 51K; Supplier: Digi-Key
U8 = DRV8834: Dual-bridge stepper or dc motor driver. 1.5A per coil with 2.5-10.8 V load supply.; Supplier 1: Digi-Key; Supplier: Digi-Key

## Sheet portExpander.SchDoc
size A4; DocumentNumber: 6; SheetNumber: 6; SheetTotal: 11
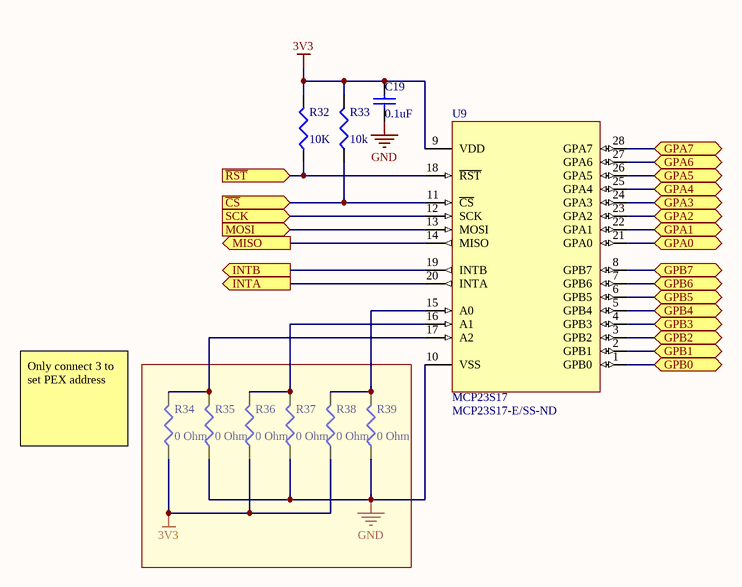
[diagram p7: portExpander.SchDoc]

### Parts
C19  0.1uF  [1608[0603]]
R32  10K  [J1-0603]
R33  10k  [J1-0603]
R34  0 Ohm  [J1-0603]
R35  0 Ohm  [J1-0603]
R36  0 Ohm  [J1-0603]
R37  0 Ohm  [J1-0603]
R38  0 Ohm  [J1-0603]
R39  0 Ohm  [J1-0603]
U9  MCP23S17  Supplier Part Number 1: MCP23S17-E/SS-ND  [SOP65P780X200-28N]

### Ports
GPA0 (bidir), GPA1 (bidir), GPA2 (bidir), GPA3 (bidir), GPA4 (bidir), GPA5 (bidir), GPA6 (bidir), GPA7 (bidir), GPB0 (bidir), GPB1 (bidir), GPB2 (bidir), GPB3 (bidir), GPB4 (bidir), GPB5 (bidir), GPB6 (bidir), GPB7 (bidir), INTA (out), INTB (out), MISO (out), MOSI (in), SCK (in), ~{CS} (in), ~{RST} (in)

### Nets
3V3: C19.2 R32.2 R33.2 R34.1 R36.1 R38.1 U9.9(VDD)
GND: C19.1 R35.1 R37.1 R39.1 U9.3(GPB2) U9.7(GPB6) U9.8(GPB7) U9.10(VSS) ; port GPB7, port GPB6, port GPB2
DECAY: U9.23(GPA2) ; port GPA2
DIR_A: U9.24(GPA3) ; port GPA3
DIR_B: U9.4(GPB3) ; port GPB3
~{EN}_A: U9.26(GPA5) ; port GPA5
~{EN}_B: U9.6(GPB5) ; port GPB5
~{FLT}_A: U9.21(GPA0) ; port GPA0
~{FLT}_B: U9.22(GPA1) ; port GPA1
INTA: U9.20(INTA) ; port INTA
INTB: U9.19(INTB) ; port INTB
M0: U9.27(GPA6) ; port GPA6
M1: U9.28(GPA7) ; port GPA7
MISO: U9.14(MISO) ; port MISO
MOSI: U9.13(MOSI) ; port MOSI
PEX_~{CS}: R33.1 U9.11(~{CS}) ; port ~{CS}
PEX_~{RST}: R32.1 U9.18(~{RST}) ; port ~{RST}
POS_LED_1: U9.2(GPB1) ; port GPB1
POS_LED_2: U9.1(GPB0) ; port GPB0
~{SLP}_A: U9.25(GPA4) ; port GPA4
~{SLP}_B: U9.5(GPB4) ; port GPB4
SCK: U9.12(SCK) ; port SCK
NetR34_2: R34.2 R35.2 U9.17(A2)
NetR36_2: R36.2 R37.2 U9.16(A1)
NetR38_2: R38.2 R39.2 U9.15(A0)

### Notes on the sheet
- (near R34) Only connect 3 to set PEX address

### Library data of the parts
C19 = Cap Semi: Capacitor (Semiconductor SIM Model); Published: 8-Jun-2000; LatestRevisionDate: 29-May-2009; LatestRevisionNote: IPC-7351 Footprint Added.; PackageReference: C1206; Publisher: Altium Limited; PackageDescription: Chip Capacitor; Value: 0.1uF; Supplier: Digi-Key; Supplier Part Number: 587-3807-1-ND
R32-R39 = Res3: Resistor; Published: 8-Jun-2000; LatestRevisionDate: 29-May-2009; LatestRevisionNote: IPC-7351 Footprint Added.; PackageReference: J1-0603; Publisher: Altium Limited; PackageDescription: Chip Resistor; Supplier: Digi-Key
  R32: Value: 10K
  R33: Value: 10k
  R34-R39: Value: 0 Ohm
U9 = MCP23S17: 16 bit I/O expander with SPI interface.; Supplier 1: Digi-Key; Supplier: Digi-Key

## Sheet positioningAndThermistor.SchDoc
size A4; DocumentNumber: 7; SheetNumber: 7; SheetTotal: 11
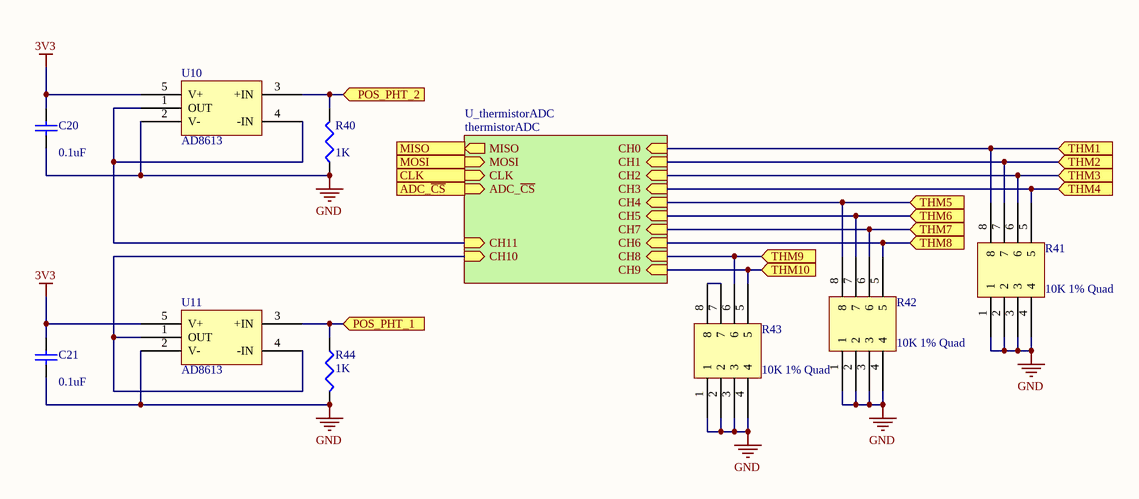
[diagram p8: positioningAndThermistor.SchDoc]

### Parts
C20  0.1uF  [0402]
C21  0.1uF  [0402]
R40  1K  [J1-0603]
R41  10K 1% Quad
R42  10K 1% Quad
R43  10K 1% Quad
R44  1K  [J1-0603]
U10  AD8613  [SOP-65P200X125-5N]
U11  AD8613  [SOP-65P200X125-5N]

### Sub-sheets
U_thermistorADC = thermistorADC: CH0 (in), CH1 (in), CH2 (in), CH3 (in), CH4 (in), CH5 (in), CH7 (in), CH6 (in), CH8 (in), CH9 (in), MOSI (in), MISO (out), ADC_~{CS} (in), CLK (in), CH11 (in), CH10 (in)

### Ports
ADC_~{CS} (in), CLK (in), MISO (out), MOSI (in), POS_PHT_1 (in), POS_PHT_2 (in), THM1 (in), THM2 (in), THM3 (in), THM4 (in), THM5 (in), THM6 (in), THM7 (in), THM8 (in), THM9 (in), THM10 (in)

### Nets
3V3: C20.2 C21.2 U10.5(V+) U11.5(V+)
GND: C20.1 C21.1 R40.1 R41.1 R41.2 R41.3 R41.4 R42.1 R42.2 R42.3 R42.4 R43.1 R43.2 R43.3 R43.4 R44.2 U10.2(V-) U11.2(V-)
ADC_~{CS}: port ADC_~{CS}, sheet U_thermistorADC/ADC_~{CS}
CH2: R41.6 ; port THM3, sheet U_thermistorADC/CH2
CH3: R41.5 ; port THM4, sheet U_thermistorADC/CH3
CH4: R42.8 ; port THM5, sheet U_thermistorADC/CH4
CH6: R42.5 ; port THM8, sheet U_thermistorADC/CH6
CH7: R42.6 ; port THM7, sheet U_thermistorADC/CH7
CH8: R43.6 ; port THM9, sheet U_thermistorADC/CH8
CH9: R43.5 ; port THM10, sheet U_thermistorADC/CH9
CH10: U11.1(OUT) U11.4(-IN) ; sheet U_thermistorADC/CH10
CH11: U10.1(OUT) U10.4(-IN) ; sheet U_thermistorADC/CH11
MISO: port MISO, sheet U_thermistorADC/MISO
MOSI: port MOSI, sheet U_thermistorADC/MOSI
POS_PHT_1: R44.1 U11.3(+IN) ; port POS_PHT_1
POS_PHT_2: R40.2 U10.3(+IN) ; port POS_PHT_2
SCK: port CLK, sheet U_thermistorADC/CLK
THM_1: R41.8 ; port THM1, sheet U_thermistorADC/CH0
THM_2: R42.7 ; port THM6, sheet U_thermistorADC/CH5
THM_3: R41.7 ; port THM2, sheet U_thermistorADC/CH1
NetR43_7: R43.7 R43.8

### Library data of the parts
C20 C21 = Cap Semi: Capacitor (Semiconductor SIM Model); Published: 8-Jun-2000; LatestRevisionDate: 29-May-2009; LatestRevisionNote: IPC-7351 Footprint Added.; PackageReference: C1206; Publisher: Altium Limited; PackageDescription: Chip Capacitor; Value: 0.1uF; Supplier: Digi-Key; Supplier Part Number: 587-3807-1-ND
R40 R44 = Res3: Resistor; Published: 8-Jun-2000; LatestRevisionDate: 29-May-2009; LatestRevisionNote: IPC-7351 Footprint Added.; PackageReference: J1-0603; Publisher: Altium Limited; PackageDescription: Chip Resistor; Value: 1K; Supplier: Digi-Key
R41-R43 = Res Quad Pack: Quad pack resistor; Value: 10K 1% Quad; Supplier: Digi-Key
U10 U11 = AD8613: Low power, low noise rail-to-rail op-amp.; Supplier: Digi-Key

## Sheet thermistorADC.SchDoc
size A4; DocumentNumber: 11; SheetNumber: 11; SheetTotal: 11
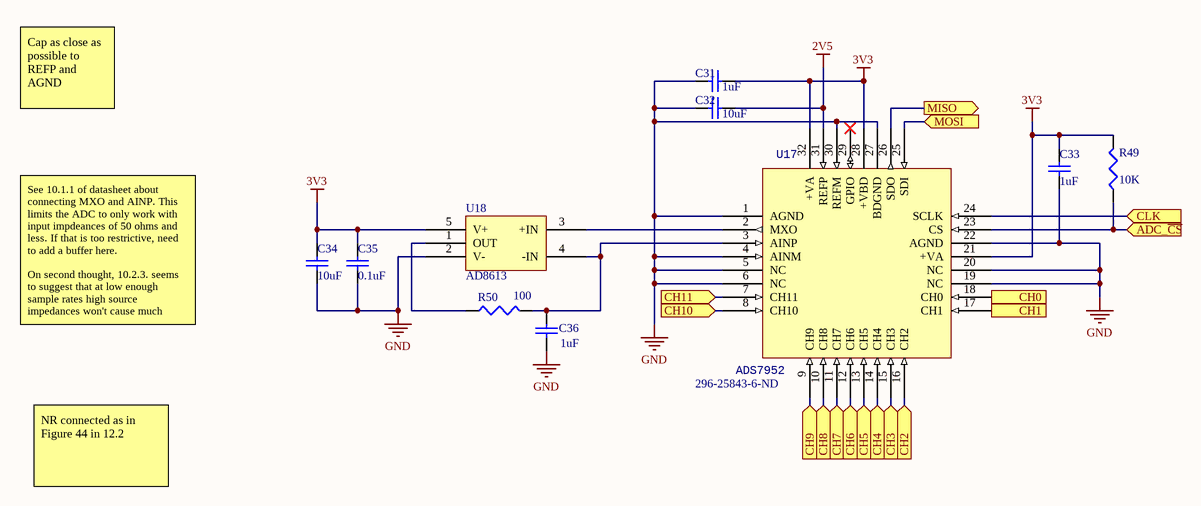
[diagram p9: thermistorADC.SchDoc]

### Parts
C31  1uF  [1608[0603]]
C32  10uF  [1608[0603]]
C33  1uF  [1608[0603]]
C34  10uF  [1608[0603]]
C35  0.1uF  [1608[0603]]
C36  1uF  [1608[0603]]
R49  10K  [J1-0603]
R50  100  [J1-0603]
U17  ADS7952  Supplier Part Number 1: 296-25843-6-ND  [QFN50P500X500X100-32N]
U18  AD8613  [SOP-65P200X125-5N]

### Ports
ADC_~{CS} (in), CH0 (in), CH1 (in), CH2 (in), CH3 (in), CH4 (in), CH5 (in), CH6 (in), CH7 (in), CH8 (in), CH9 (in), CH10 (in), CH11 (in), CLK (in), MISO (out), MOSI (in)

### Nets
2V5: C32.2 U17.31(REFP)
3V3: C31.2 C33.2 C34.2 C35.2 R49.2 U17.21(+VA) U17.28(+VBD) U17.32(+VA) U18.5(V+)
GND: C31.1 C32.1 C33.1 C34.1 C35.1 C36.1 U17.1(AGND) U17.4(AINM) U17.5(NC) U17.6(NC) U17.19(NC) U17.20(NC) U17.22(AGND) U17.27(BDGND) U17.30(REFM) U18.2(V-)
ADC_~{CS}: R49.1 U17.23(CS) ; port ADC_~{CS}
CH2: U17.16(CH2) ; port CH2
CH3: U17.15(CH3) ; port CH3
CH4: U17.14(CH4) ; port CH4
CH6: U17.12(CH6) ; port CH6
CH7: U17.11(CH7) ; port CH7
CH8: U17.10(CH8) ; port CH8
CH9: U17.9(CH9) ; port CH9
CH10: U17.8(CH10) ; port CH10
CH11: U17.7(CH11) ; port CH11
MISO: U17.26(SDO) ; port MISO
MOSI: U17.25(SDI) ; port MOSI
SCK: U17.24(SCLK) ; port CLK
THM_1: U17.18(CH0) ; port CH0
THM_2: U17.13(CH5) ; port CH5
THM_3: U17.17(CH1) ; port CH1
NetC36_2: C36.2 R50.2 U17.3(AINP) U18.4(-IN)
NetR50_1: R50.1 U18.1(OUT)
NetU17_2: U17.2(MXO) U18.3(+IN)

Not connected (* = marked no-connect by the designer): U17 29(GPIO)*

### Notes on the sheet
- Cap as close as possible to REFP and AGND
- See 10.1.1 of datasheet about connecting MXO and AINP. This limits the ADC to only work with input impdeances of 50 ohms and less. If that is too restrictive, need to add a buffer here.
  On second thought, 10.2.3. seems to suggest that at low enough sample rates high source impedances won't cause much issue.
- NR connected as in Figure 44 in 12.2

### Library data of the parts
C31 C33-C36 = Cap Semi: Capacitor (Semiconductor SIM Model); Published: 8-Jun-2000; LatestRevisionDate: 29-May-2009; LatestRevisionNote: IPC-7351 Footprint Added.; PackageReference: C1206; Publisher: Altium Limited; PackageDescription: Chip Capacitor; Supplier: Digi-Key
  C31 C33 C36: Value: 1uF; Supplier Part Number: 490-1550-1-ND
  C34: Value: 10uF; Supplier Part Number: 587-3258-1-ND
  C35: Value: 0.1uF; Supplier Part Number: 587-3807-1-ND
C32 = Cap: Capacitor; Published: 8-Jun-2000; LatestRevisionDate: 17-Jul-2002; LatestRevisionNote: Re-released for DXP Platform.; PackageReference: *; Publisher: Altium Limited; PackageDescription: Radial Cap, Thru-Hole; 2 Leads; 0.3 in Pin Spacing; Value: 10uF; Supplier: Digi-Key; Supplier Part Number: 587-3258-1-ND
R49 R50 = Res3: Resistor; Published: 8-Jun-2000; LatestRevisionDate: 29-May-2009; LatestRevisionNote: IPC-7351 Footprint Added.; PackageReference: J1-0603; Publisher: Altium Limited; PackageDescription: Chip Resistor; Supplier: Digi-Key
  R49: Value: 10K
  R50: Value: 100
U17 = ADS7952: ADC; Supplier 1: Digi-Key; Supplier: Digi-Key
U18 = AD8613: as U10 on sheet positioningAndThermistor; Supplier: Digi-Key

## Sheet sensors-digital.SchDoc
size A4
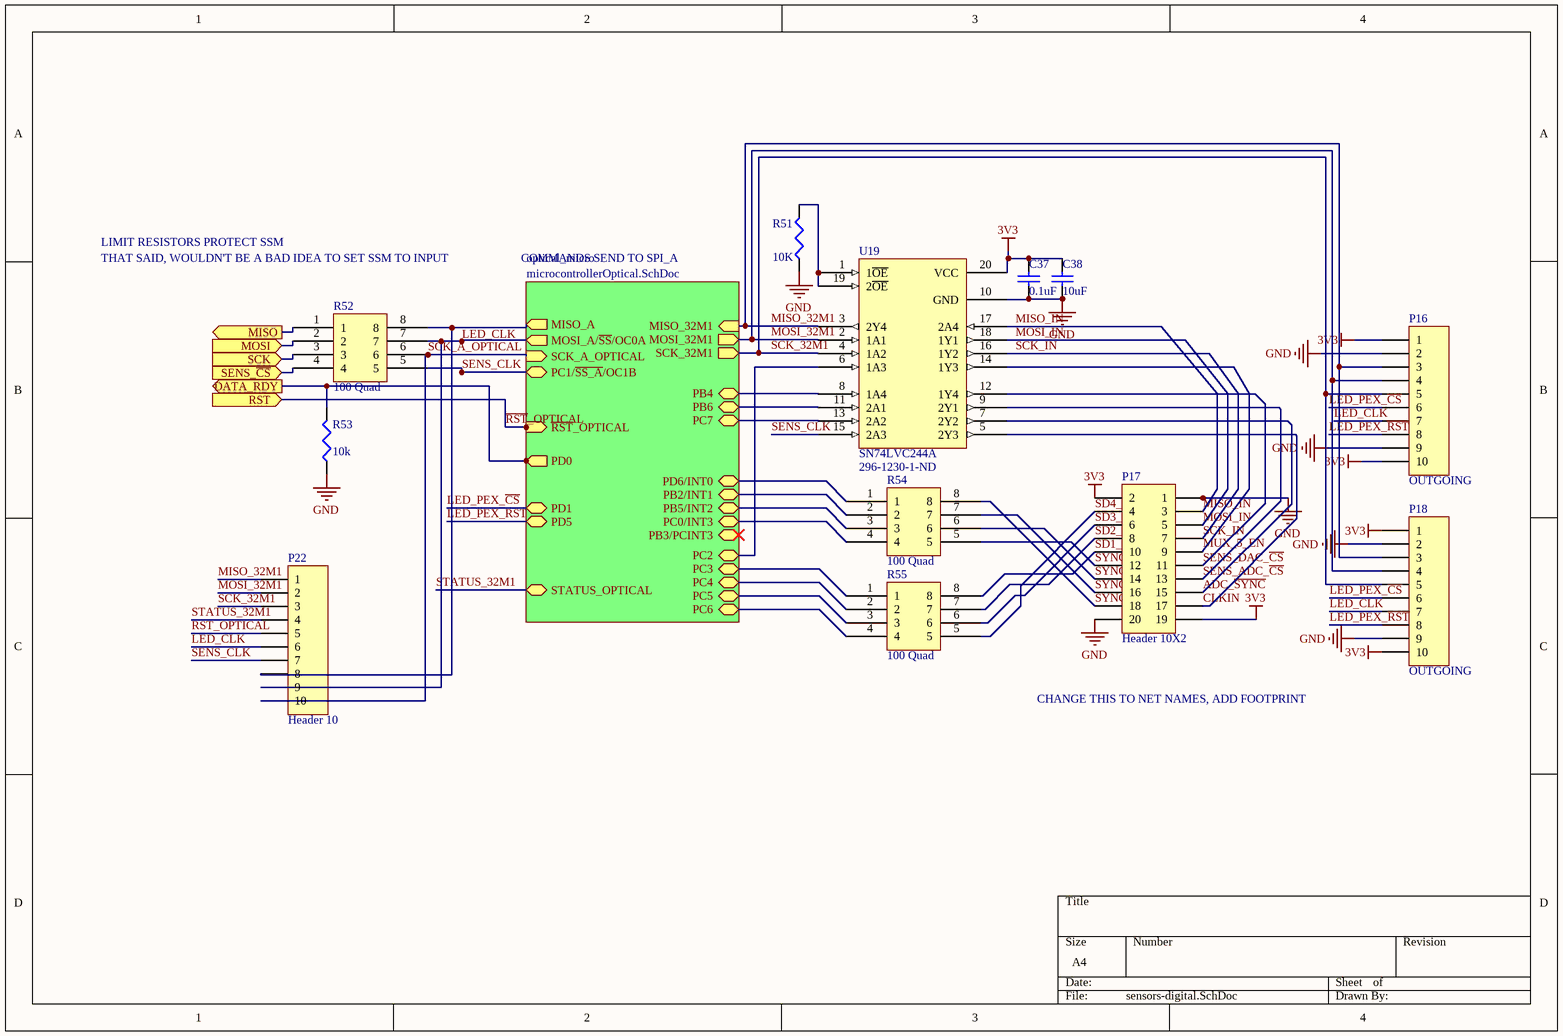
[diagram p10: sensors-digital.SchDoc]

### Parts
(Parts that share a designator on the sheet are numbered #1, #2 ... from top to bottom, then left to right.)
C37  0.1uF  [1608[0603]]
C38  10uF  [1608[0603]]
P16  OUTGOING  [DF14-10P-1.25H(55)]
P17  Header 10X2  [CON20_2X10_Female]
P18  OUTGOING  [DF14-10P-1.25H(55)]
P22  Header 10  [HDR1X10]
R51  10K  [J1-0603]
R52  100 Quad  [ResQuad-320X150]
R53  10k  [J1-0603]
R54#2  100 Quad  [ResQuad-320X150]
R55#2  100 Quad  [ResQuad-320X150]
U19#2  SN74LVC244A  Supplier Part Number 1: 296-1230-1-ND  [SOP65P650X440-20N]

### Sub-sheets
optical_micro = microcontrollerOptical.SchDoc: PB5/INT2 (bidir), MOSI_32M1 (out), PC2 (bidir), PC3 (bidir), SCK_32M1 (out), PB4 (bidir), PB6 (bidir), PC0/INT3 (bidir), MISO_A (out), PB3/PCINT3 (bidir), MISO_32M1 (in), PC6 (bidir), PC4 (bidir), PC1/~{SS_A}/OC1B (bidir), PC7 (bidir), PD5 (bidir), PB2/INT1 (bidir), SCK_A_OPTICAL (in), PD0 (out), ~{RST}_OPTICAL (in), MOSI_A/~{SS}/OC0A (out), PD6/INT0 (bidir), PC5 (bidir), PD1 (bidir), STATUS_OPTICAL (bidir)

### Ports
DATA_RDY (out), MISO (out), MOSI (in), RST (in), SCK (in), SENS_~{CS} (in)

### Nets
3V3: C37.2 C38.2 P16.1 P16.10 P17.2 P17.19 P18.1 P18.10 U19#2.20(VCC)
GND: C37.1 C38.1 P16.2 P16.9 P17.1 P17.20 P18.2 P18.9 R51.1 R53.1 U19#2.10(GND)
ADC_~{SYNC}: P17.15 U19#2.7(2Y2)
CLKIN: P17.17 U19#2.5(2Y3)
DATA_RDY: R53.2 ; port DATA_RDY, sheet optical_micro/PD0
LED_CLK: P16.7 P18.7 P22.6 P22.9 R52.7 ; sheet optical_micro/MOSI_A/~{SS}/OC0A
LED_PEX_~{CS}: P16.6 P18.6 ; sheet optical_micro/PD1
LED_PEX_~{RST}: P16.8 P18.8 ; sheet optical_micro/PD5
MISO: R52.1 ; port MISO
MISO_32M1: P16.3 P18.3 P22.1 U19#2.3(2Y4) ; sheet optical_micro/MISO_32M1
MISO_A: P22.8 R52.8 ; sheet optical_micro/MISO_A
MISO_IN: P17.3 U19#2.17(2A4)
MOSI: R52.2 ; port MOSI
MOSI_32M1: P16.4 P18.4 P22.2 U19#2.2(1A1) ; sheet optical_micro/MOSI_32M1
MOSI_IN: P17.5 U19#2.18(1Y1)
MUX_5_EN: P17.9 U19#2.14(1Y3)
PB2/INT1: R54#2.2 ; sheet optical_micro/PB2/INT1
PB4: U19#2.8(1A4) ; sheet optical_micro/PB4
PB5/INT2: R54#2.3 ; sheet optical_micro/PB5/INT2
PB6: U19#2.11(2A1) ; sheet optical_micro/PB6
PC0/INT3: R54#2.4 ; sheet optical_micro/PC0/INT3
PC2: U19#2.6(1A3) ; sheet optical_micro/PC2
PC3: R55#2.1 ; sheet optical_micro/PC3
PC4: R55#2.2 ; sheet optical_micro/PC4
PC5: R55#2.3 ; sheet optical_micro/PC5
PC6: R55#2.4 ; sheet optical_micro/PC6
PC7: U19#2.13(2A2) ; sheet optical_micro/PC7
PD6/INT0: R54#2.1 ; sheet optical_micro/PD6/INT0
~{RST}_OPTICAL: P22.5 ; port RST, sheet optical_micro/~{RST}_OPTICAL
SCK: R52.3 ; port SCK
SCK_32M1: P16.5 P18.5 P22.3 U19#2.4(1A2) ; sheet optical_micro/SCK_32M1
SCK_A_OPTICAL: P22.10 R52.6 ; sheet optical_micro/SCK_A_OPTICAL  [project net RXLIN_OPTICAL]
SCK_IN: P17.7 U19#2.16(1Y2)
SD1_~{CS}: P17.10 R55#2.8
SD2_~{CS}: P17.8 R55#2.7
SD3_~{CS}: P17.6 R55#2.6
SD4_~{CS}: P17.4 R55#2.5
SENS_ADC_~{CS}: P17.13 U19#2.9(2Y1)
SENS_~{CS}: R52.4 ; port SENS_~{CS}
SENS_CLK: P22.7 R52.5 U19#2.15(2A3) ; sheet optical_micro/PC1/~{SS_A}/OC1B
SENS_DAC_~{CS}: P17.11 U19#2.12(1Y4)
STATUS_32M1: P22.4 ; sheet optical_micro/STATUS_OPTICAL
SYNCO1: P17.18 R54#2.8
SYNCO2: P17.16 R54#2.7
SYNCO3: P17.14 R54#2.6
SYNCO4: P17.12 R54#2.5
NetR51_2: R51.2 U19#2.1(1~{OE}) U19#2.19(2~{OE})

### Notes on the sheet
- LIMIT RESISTORS PROTECT SSM
- THAT SAID, WOULDN'T BE A BAD IDEA TO SET SSM TO INPUT
- COMMANDS SEND TO SPI_A
- CHANGE THIS TO NET NAMES, ADD FOOTPRINT

### Library data of the parts
C37 C38 = Cap Semi: Capacitor (Semiconductor SIM Model); Published: 8-Jun-2000; LatestRevisionDate: 29-May-2009; LatestRevisionNote: IPC-7351 Footprint Added.; PackageReference: C1206; Publisher: Altium Limited; PackageDescription: Chip Capacitor; Supplier: Digi-Key
  C37: Value: 0.1uF
  C38: Value: 10uF
P16 P18 P22 = Header 10: Header, 10-Pin; LatestRevisionDate: 17-Jul-2002; LatestRevisionNote: Re-released for DXP Platform.; Publisher: Altium Limited
  P16 P18: Supplier: Digi-Key
P17 = Header 10X2: Header, 10-Pin, Dual row; LatestRevisionDate: 17-Jul-2002; LatestRevisionNote: Re-released for DXP Platform.; Publisher: Altium Limited
R51 R53 = Res3: Resistor; Published: 8-Jun-2000; LatestRevisionDate: 29-May-2009; LatestRevisionNote: IPC-7351 Footprint Added.; PackageReference: J1-0603; Publisher: Altium Limited; PackageDescription: Chip Resistor; Supplier: Digi-Key
  R51: Value: 10K
  R53: Value: 10k
R52 R54#2 R55#2 = Res Quad Pack: Quad pack resistor; Value: 100 Quad; Supplier: Digi-Key; Supplier Part Number: Y4101CT-ND
U19#2 = SN74LVC244A: Octal buffer or driver with 3-state outputs.; Supplier 1: Digi-Key; Supplier: Digi-Key

## Sheet microcontrollerOptical.SchDoc: MICRO-OPTICAL
size A4; DrawnBy: Dylan Vogel; Organization: UTAT SS; DocumentNumber: 2; Revision: 1; SheetNumber: 2; SheetTotal: 7
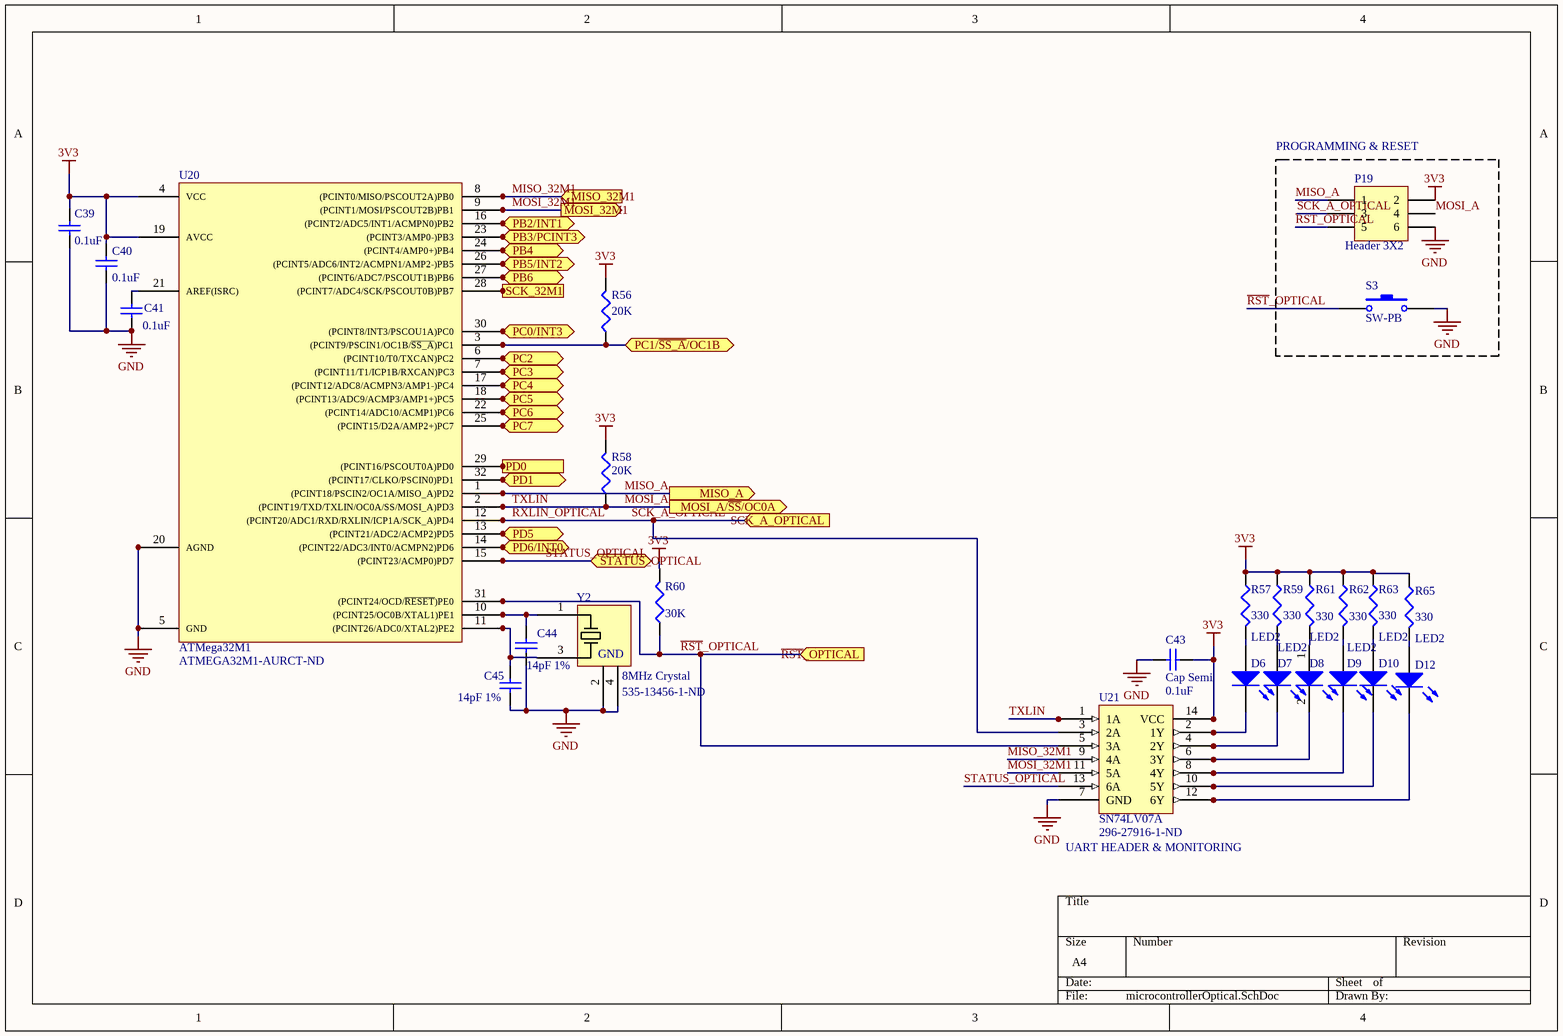
[diagram p11: microcontrollerOptical.SchDoc]

### Parts
C39  0.1uF  [1608[0603]]
C40  0.1uF  [1608[0603]]
C41  0.1uF  [1608[0603]]
C43  Cap Semi  value 0.1uF  [1608[0603]]
C44  value 14pF 1%  [1608[0603]]  (hidden comment: 15pF 1%)
C45  value 14pF 1%  [1608[0603]]  (hidden comment: 15pF 1%)
D6  LED2  [0603-LED]
D7  LED2  [0603-LED]
D8  LED2  [0603-LED]
D9  LED2  [0603-LED]
D10  LED2  [0603-LED]
D12  LED2  [0603-LED]
P19  Header 3X2  [HDR2X3]
R56  20K  [J1-0603]
R57  330  [J1-0603]
R58  20K  [J1-0603]
R59  330  [J1-0603]
R60  30K  [J1-0603]
R61  330  [J1-0603]
R62  330  [J1-0603]
R63  330  [J1-0603]
R65  330  [J1-0603]
S3  SW-PB  [Pushbutton]
U20  ATMega32M1  Supplier Part Number 1: ATMEGA32M1-AURCT-ND  [QFP80P900X900X120-32N]
U21  SN74LV07A  Supplier Part Number: 296-27916-1-ND  [SOP65P640X120-14N]
Y2  8MHz Crystal  Supplier Part Number 1: 535-13456-1-ND  [OSCSC500X320X110-4N]

### Blocks framed on the sheet
PROGRAMMING & RESET: P19 S3

### Ports
MISO_32M1 (in), MISO_A (out), MOSI_32M1 (out), MOSI_A/~{SS}/OC0A (out), PB2/INT1 (bidir), PB3/PCINT3 (bidir), PB4 (bidir), PB5/INT2 (bidir), PB6 (bidir), PC0/INT3 (bidir), PC1/~{SS_A}/OC1B (bidir), PC2 (bidir), PC3 (bidir), PC4 (bidir), PC5 (bidir), PC6 (bidir), PC7 (bidir), PD0 (out), PD1 (bidir), PD5 (bidir), PD6/INT0 (bidir), SCK_32M1 (out), SCK_A_OPTICAL (in), STATUS_OPTICAL (bidir), ~{RST}_OPTICAL (in)

### Nets
3V3: C39.2 C40.2 C43.2 P19.2 R56.2 R57.1 R58.2 R59.1 R60.2 R61.1 R62.1 R63.1 R65.1 U20.4(VCC) U20.19(AVCC) U21.14(VCC)
GND: C39.1 C40.1 C41.2 C43.1 C44.1 C45.1 P19.6 S3.2 U20.5(GND) U20.20(AGND) U21.7(GND) Y2.2 Y2.4
DATA_RDY: U20.29((PCINT16/PSCOUT0A)PD0) ; port PD0
LED_PEX_~{CS}: U20.32((PCINT17/CLKO/PSCIN0)PD1) ; port PD1
LED_PEX_~{RST}: U20.13((PCINT21/ADC2/ACMP2)PD5) ; port PD5
MISO_32M1: U20.8((PCINT0/MISO/PSCOUT2A)PB0) U21.9(4A) ; port MISO_32M1
MISO_A: P19.1 U20.1((PCINT18/PSCIN2/OC1A/MISO_A)PD2) ; port MISO_A
MOSI_32M1: U20.9((PCINT1/MOSI/PSCOUT2B)PB1) U21.11(5A) ; port MOSI_32M1
MOSI_A: P19.4 R58.1 U20.2((PCINT19/TXD/TXLIN/OC0A/SS/MOSI_A)PD3) U21.1(1A) ; port MOSI_A/~{SS}/OC0A  [also labelled TXLIN]  [project net LED_CLK]
PB2/INT1: U20.16((PCINT2/ADC5/INT1/ACMPN0)PB2) ; port PB2/INT1
PB3/PCINT3: U20.23((PCINT3/AMP0-)PB3) ; port PB3/PCINT3
PB4: U20.24((PCINT4/AMP0+)PB4) ; port PB4
PB5/INT2: U20.26((PCINT5/ADC6/INT2/ACMPN1/AMP2-)PB5) ; port PB5/INT2
PB6: U20.27((PCINT6/ADC7/PSCOUT1B)PB6) ; port PB6
PC0/INT3: U20.30((PCINT8/INT3/PSCOU1A)PC0) ; port PC0/INT3
PC2: U20.6((PCINT10/T0/TXCAN)PC2) ; port PC2
PC3: U20.7((PCINT11/T1/ICP1B/RXCAN)PC3) ; port PC3
PC4: U20.17((PCINT12/ADC8/ACMPN3/AMP1-)PC4) ; port PC4
PC5: U20.18((PCINT13/ADC9/ACMP3/AMP1+)PC5) ; port PC5
PC6: U20.22((PCINT14/ADC10/ACMP1)PC6) ; port PC6
PC7: U20.25((PCINT15/D2A/AMP2+)PC7) ; port PC7
PD6/INT0: U20.14((PCINT22/ADC3/INT0/ACMPN2)PD6) ; port PD6/INT0
~{RST}_OPTICAL: P19.5 R60.1 S3.1 U20.31((PCINT24/OCD/~{RESET})PE0) U21.5(3A) ; port ~{RST}_OPTICAL
RXLIN_OPTICAL: P19.3 U20.12((PCINT20/ADC1/RXD/RXLIN/ICP1A/SCK_A)PD4) U21.3(2A) ; port SCK_A_OPTICAL  [also labelled SCK_A_OPTICAL]
SCK_32M1: U20.28((PCINT7/ADC4/SCK/PSCOUT0B)PB7) ; port SCK_32M1
SENS_CLK: R56.1 U20.3((PCINT9/PSCIN1/OC1B/~{SS_A})PC1) ; port PC1/~{SS_A}/OC1B
STATUS_OPTICAL: U20.15((PCINT23/ACMP0)PD7) U21.13(6A) ; port STATUS_OPTICAL  [project net STATUS_32M1]
NetC41_1: C41.1 U20.21(AREF(ISRC))
NetC44_2: C44.2 U20.10((PCINT25/OC0B/XTAL1)PE1) Y2.1(IN)
NetC45_2: C45.2 U20.11((PCINT26/ADC0/XTAL2)PE2) Y2.3(IN)
NetD6_1: D6.1(A) R57.2
NetD6_2: D6.2(K) U21.2(1Y)
NetD7_1: D7.1(A) R59.2
NetD7_2: D7.2(K) U21.4(2Y)
NetD8_1: D8.1(A) R61.2
NetD8_2: D8.2(K) U21.6(3Y)
NetD9_1: D9.1(A) R62.2
NetD9_2: D9.2(K) U21.8(4Y)
NetD10_1: D10.1(A) R63.2
NetD10_2: D10.2(K) U21.10(5Y)
NetD12_1: D12.1(A) R65.2
NetD12_2: D12.2(K) U21.12(6Y)

### Notes on the sheet
- (near U21) UART HEADER & MONITORING
- (in symbol 8MHz Abracom 4-Pin Crystal) GND

### Library data of the parts
C39-C41 C43-C45 = Cap Semi: Capacitor (Semiconductor SIM Model); Published: 8-Jun-2000; LatestRevisionDate: 29-May-2009; LatestRevisionNote: IPC-7351 Footprint Added.; PackageReference: C1206; Publisher: Altium Limited; PackageDescription: Chip Capacitor
  C39-C41: Value: 0.1uF; Supplier: Digi-Key
  C44 C45: Supplier: Digi-Key; Supplier Part Number: 490-16416-1-ND
D6-D10 D12 = LED2: as D1 on sheet ATmega32M1; Published: 8-Jun-2000; LatestRevisionDate: 17-Jul-2002; LatestRevisionNote: Re-released for DXP Platform.; PackageVersion: Feb-2002; PackageReference: 3.2X1.6X1.1; Publisher: Altium Limited; PackageDescription: SM LED; 2 Flat Leads; Supplier: Digi-Key
P19 = Header 3X2: Header, 3-Pin, Dual row; LatestRevisionDate: 17-Jul-2002; LatestRevisionNote: Re-released for DXP Platform.; Publisher: Altium Limited; Supplier: Digi-Key
R56-R63 R65 = Res3: Resistor; Published: 8-Jun-2000; LatestRevisionDate: 29-May-2009; LatestRevisionNote: IPC-7351 Footprint Added.; PackageReference: J1-0603; Publisher: Altium Limited; PackageDescription: Chip Resistor; Supplier: Digi-Key
  R56 R58: Value: 20K
  R57 R59 R61-R63 R65: Value: 330
  R60: Value: 30K
S3 = SW-PB: Switch; Published: 24-Mar-1999; LatestRevisionDate: 17-Jul-2002; LatestRevisionNote: Re-released for DXP Platform.; PackageReference: SPST-2; Publisher: Altium Limited; PackageDescription: Switch; 2 Leads
U20 = ATMega32M1: Atmel 8-bit AVR microcontroller.; Supplier 1: Digi-Key; Supplier: Digi-Key
U21 = SN74LV07A: as U3 on sheet ATmega32M1; Supplier: Digi-Key
Y2 = 8MHz Abracom 4-Pin Crystal: 8MHz Abracom 4-pin crystal.; Supplier 1: Digi-Key

## Sheet power2V5.SchDoc
size A4; DocumentNumber: 8; SheetNumber: 8; SheetTotal: 11
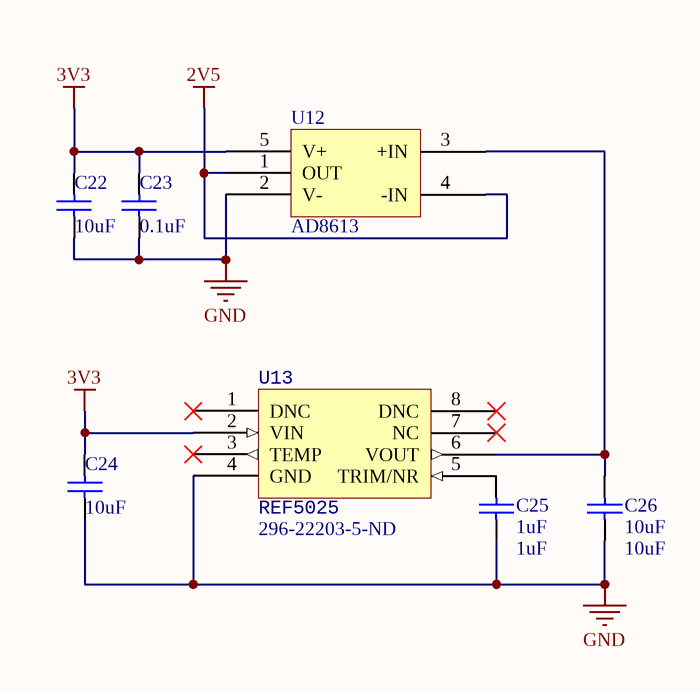
[diagram p12: power2V5.SchDoc]

### Parts
C22  10uF  [1608[0603]]
C23  0.1uF  [1608[0603]]
C24  10uF  [1608[0603]]
C25  1uF  [1608[0603]]
C26  10uF  [1608[0603]]
U12  AD8613  [SOP-65P200X125-5N]
U13  REF5025  Supplier Part Number 1: 296-22203-5-ND  [SOIC127P500X600-8N]

### Nets
2V5: U12.1(OUT) U12.4(-IN)
3V3: C22.2 C23.2 C24.2 U12.5(V+) U13.2(VIN)
GND: C22.1 C23.1 C24.1 C25.1 C26.1 U12.2(V-) U13.4(GND)
NetC25_2: C25.2 U13.5(TRIM/NR)
NetC26_2: C26.2 U12.3(+IN) U13.6(VOUT)

Not connected (* = marked no-connect by the designer): U13 1(DNC)* 3(TEMP)* 7(NC)* 8(DNC)*

### Library data of the parts
C22-C26 = Cap Semi: Capacitor (Semiconductor SIM Model); Published: 8-Jun-2000; LatestRevisionDate: 29-May-2009; LatestRevisionNote: IPC-7351 Footprint Added.; PackageReference: C1206; Publisher: Altium Limited; PackageDescription: Chip Capacitor; Supplier: Digi-Key
  C22 C24 C26: Value: 10uF; Supplier Part Number: 587-3258-1-ND
  C23: Value: 0.1uF; Supplier Part Number: 587-3807-1-ND
  C25: Value: 1uF; Supplier Part Number: 490-1550-1-ND
U12 = AD8613: as U10 on sheet positioningAndThermistor; Supplier: Digi-Key
U13 = REF5025: Voltage Reference; Supplier 1: Digi-Key; Supplier: Digi-Key